# Altium project EasyARM-i.MX283-EV.PrjPcb (part 1 of 2)
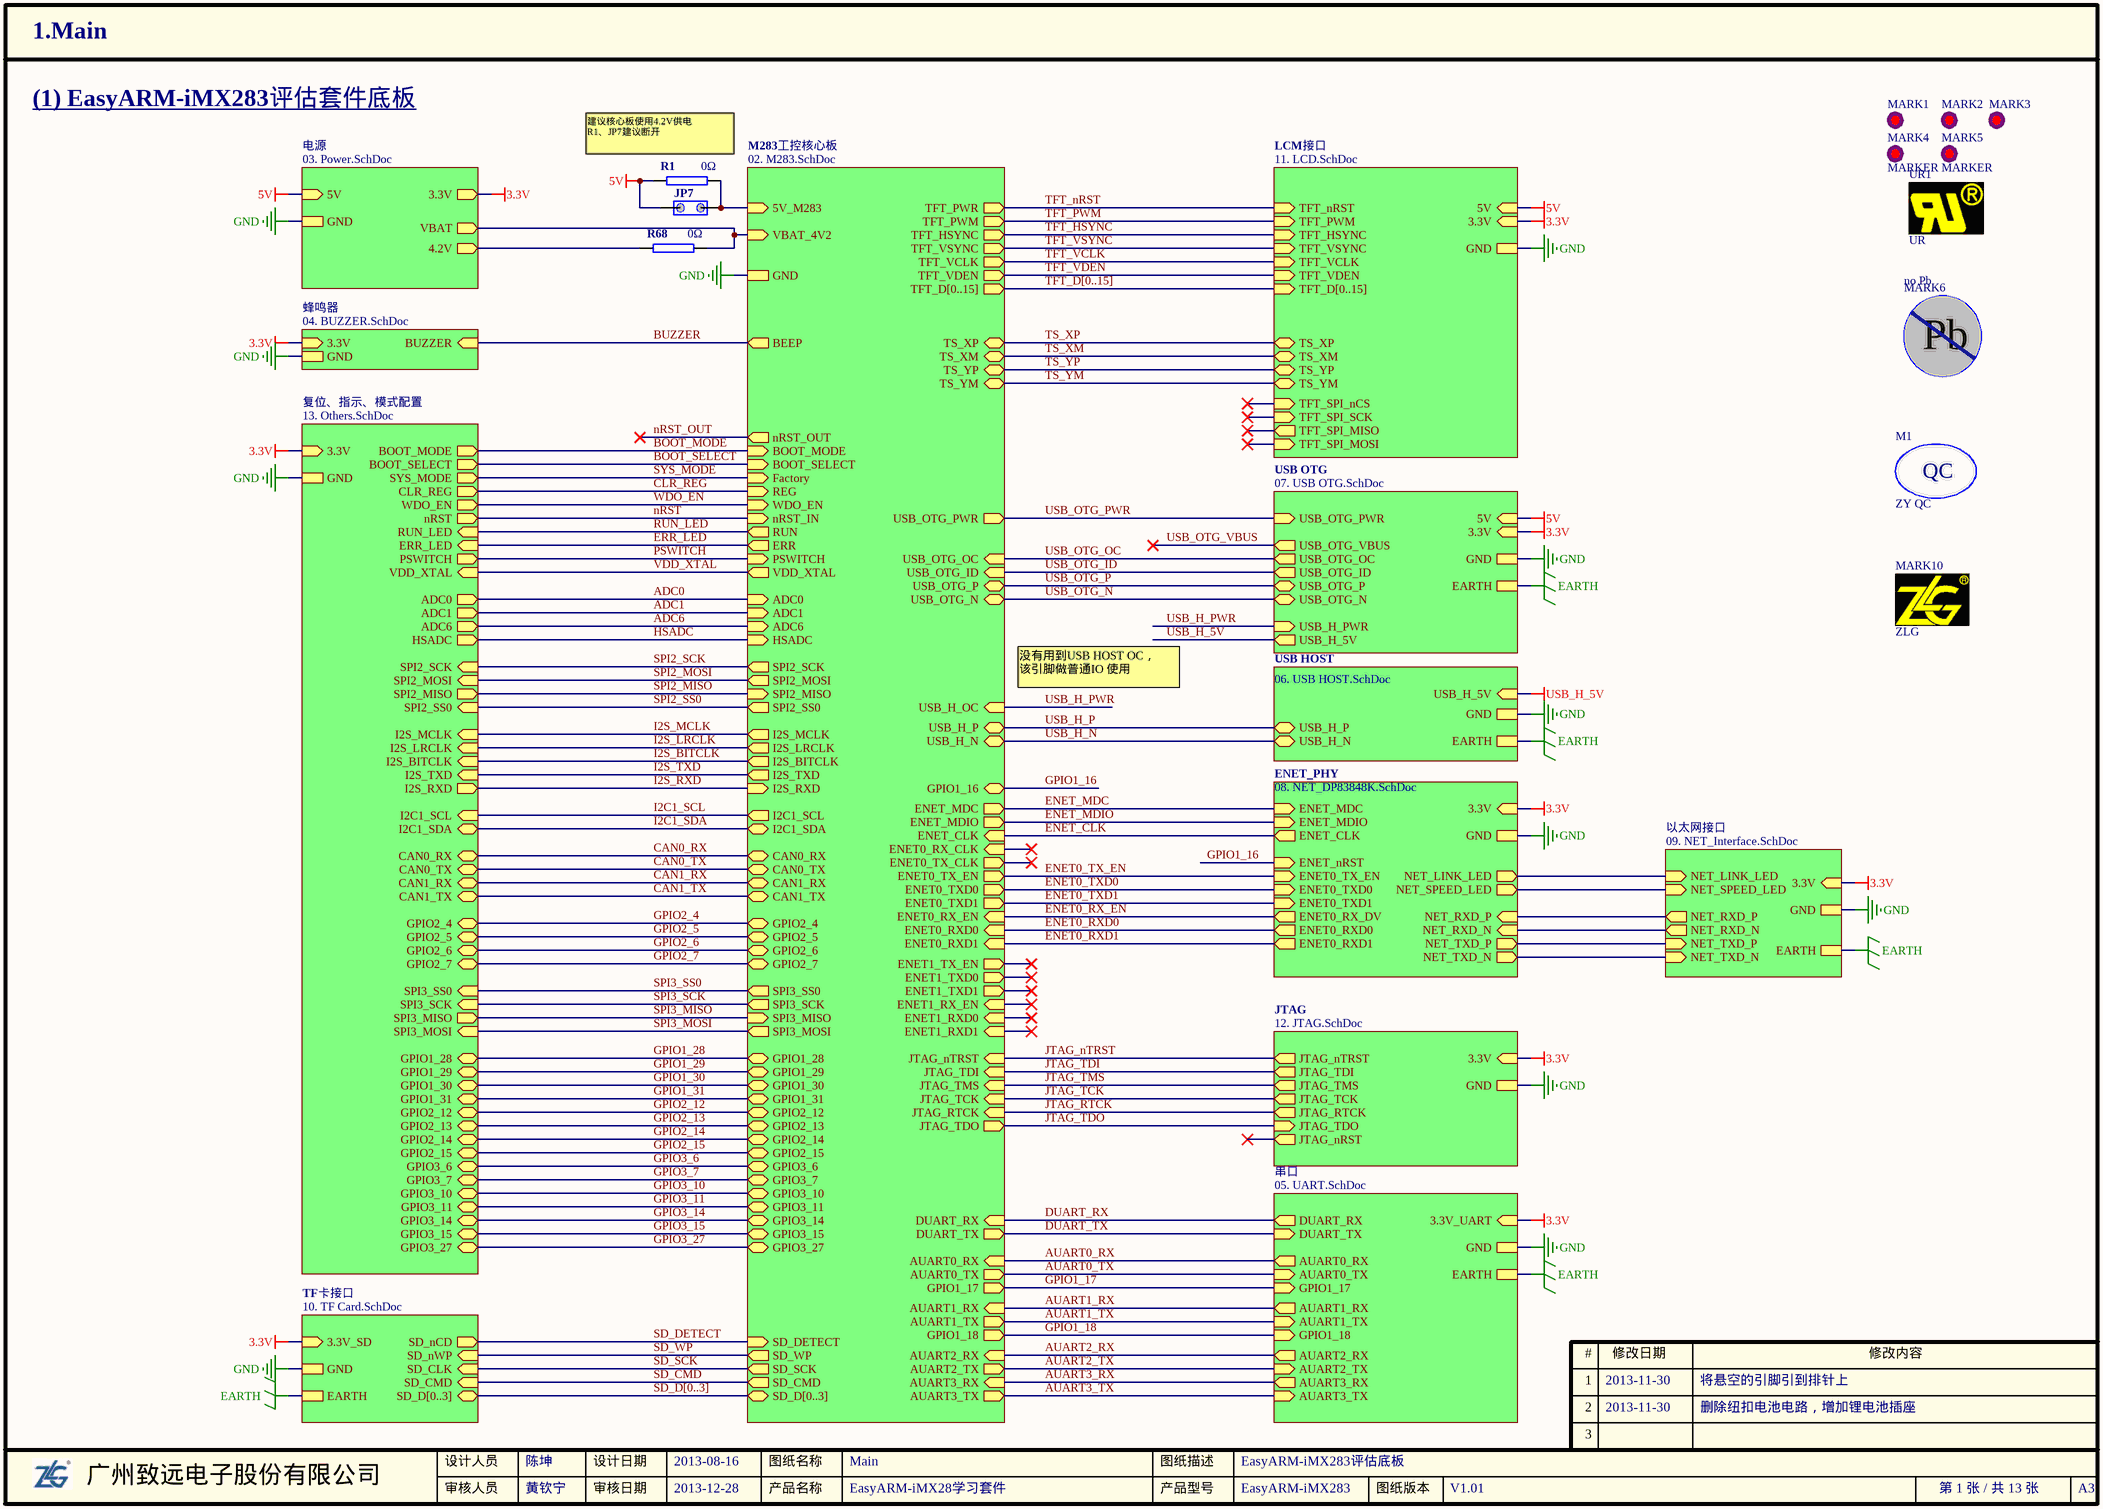
[diagram p0: 01. Main.SchDoc]
ProductModel: SmartARM6540; ProductName: SmartARM6540评估底板
13 sheets, 209 parts. Net scope: hierarchical (ports join the sheet entries above them; power ports are global).
Sheets:
  01. Main.SchDoc
    M283工控核心板 = 02. M283.SchDoc
    串口 = 05. UART.SchDoc
    USB OTG = 07. USB OTG.SchDoc
    USB HOST = 06. USB HOST.SchDoc
    以太网接口 = 09. NET_Interface.SchDoc
    ENET_PHY = 08. NET_DP83848K.SchDoc
    TF卡接口 = 10. TF Card.SchDoc
    LCM接口 = 11. LCD.SchDoc
    电源 = 03. Power.SchDoc
    复位、指示、模式配置 = 13. Others.SchDoc
    JTAG = 12. JTAG.SchDoc
    蜂鸣器 = 04. BUZZER.SchDoc

## Sheet 01. Main.SchDoc
size A3; CheckedBy: 黄钦宁; Author: 陈坤; DocumentNumber: 1; SheetNumber: 1; SheetTotal: 13; PageSetup: Record=PageOptions|CenterHorizontal=True|CenterVertical=True|PrintScale=1.00|XCorrection=1.00|YCorrection=1.00|PrintKind=0|BorderSize=5000000|LeftOffset=0|BottomOffset=0|Orientation=2|PaperLength=1000|PaperWidth=1000|Scale=100|PaperSource=7|PrintQuality=600|MediaType=1|DitherType=10|PaperKind=A4|PrintScaleMode=1; DesignDate: 2013-08-16; CheckDate: 2013-12-28; SheetName: Main; SheetVersion: V1.01; SheetDescription: EasyARM-iMX283评估底板; ModifiedDate1: 2013-11-30; ModifiedDate2: 2013-11-30; ModifiedContent1: 将悬空的引脚引到排针上; ModifiedContent2: 删除纽扣电池电路，增加锂电池插座; ProductName: EasyARM-iMX28学习套件; ProductModel: EasyARM-iMX283

### Parts
JP7  120Ω_EN  [SIP-2]  (value not drawn)
M1  ZY QC  [ZY_QC]  (no BOM)
MARK1  MARKER  [MARKER-C]  (value not drawn)
MARK2  MARKER  [MARKER-C]  (value not drawn)
MARK3  MARKER  [MARKER-C]  (value not drawn)
MARK4  MARKER  [MARKER-C]
MARK5  MARKER  [MARKER-C]
MARK6  no Pb  [ZY_no Pb-4]
MARK10  ZLG  [ZLG0.7]  (no BOM)
R1  0Ω  [0603R]
R68  0Ω  [0603R]
UR1  UR  [ZY_UR-3X2]

### Sub-sheets
ENET_PHY = 08. NET_DP83848K.SchDoc: 3.3V, NET_LINK_LED (out), NET_SPEED_LED (out), NET_RXD_P (in), NET_RXD_N (in), GND, NET_TXD_P (out), NET_TXD_N (out), ENET_nRST (in), ENET_MDC (in), ENET_MDIO (in), ENET0_TX_EN (in), ENET0_RX_DV (out), ENET_CLK (out), ENET0_TXD0 (in), ENET0_TXD1 (in), ENET0_RXD0 (out), ENET0_RXD1 (out)
JTAG = 12. JTAG.SchDoc: 3.3V, GND, JTAG_nTRST (out), JTAG_TDI (out), JTAG_TMS (out), JTAG_TCK (out), JTAG_RTCK (out), JTAG_TDO (in), JTAG_nRST (out)
LCM接口 = 11. LCD.SchDoc: 5V, 3.3V, GND, TS_XP (bidir), TS_XM (bidir), TS_YP (bidir), TS_YM (bidir), TFT_D[0..15] (in), TFT_PWM (in), TFT_HSYNC (in), TFT_VSYNC (in), TFT_VCLK (in), TFT_VDEN (in), TFT_SPI_MISO (out), TFT_SPI_MOSI (in), TFT_SPI_nCS (in), TFT_SPI_SCK (in), TFT_nRST (in)
M283工控核心板 = 02. M283.SchDoc: 5V_M283, GND, Factory (in), BOOT_MODE (in), BOOT_SELECT (in), WDO_EN (in), nRST_IN (in), nRST_OUT (out), RUN (out), ERR (out), BEEP (out), SD_DETECT (in), SD_SCK (out), SD_WP (out), SD_D[0..3] (bidir), SD_CMD (out), DUART_RX (in), DUART_TX (out), TFT_VSYNC (out), TFT_HSYNC (out), TFT_VCLK (out), TFT_VDEN (out), TFT_PWM (out), TFT_D[0..15] (out), TS_XP (bidir), TS_XM (bidir), TS_YP (bidir), TS_YM (bidir), ADC0 (in), ADC1 (in), ADC6 (in), HSADC (in), USB_H_N (bidir), USB_H_P (bidir), USB_OTG_OC (in), USB_OTG_ID (in), USB_OTG_P (bidir), USB_OTG_N (bidir), SPI2_MOSI (out), SPI2_MISO (in), SPI2_SCK (out), SPI2_SS0 (out), JTAG_TCK (in), JTAG_TMS (in), JTAG_TDI (in), JTAG_TDO (out), JTAG_RTCK (in), JTAG_nTRST (in), REG (in), VBAT_4V2 (in), PSWITCH (in), I2S_BITCLK (out), I2S_LRCLK (out), I2S_MCLK (out), I2S_TXD (out), I2S_RXD (in), I2C1_SCL (out), I2C1_SDA (bidir), CAN0_RX (bidir), CAN0_TX (bidir), CAN1_RX (bidir), CAN1_TX (bidir), AUART0_TX (out), AUART0_RX (in), AUART1_RX (in), AUART1_TX (out), GPIO1_17 (out), AUART2_RX (in), AUART2_TX (out), GPIO1_18 (out), AUART3_RX (in), AUART3_TX (out), USB_H_OC (in), USB_OTG_PWR (out), SPI3_MISO (in), SPI3_MOSI (out), SPI3_SCK (out), SPI3_SS0 (out), ENET_MDC (out), ENET_MDIO (out), ENET0_TX_CLK (out), ENET0_TX_EN (out), ENET0_RX_EN (in), ENET0_RX_CLK (in), VDD_XTAL (out), TFT_PWR (out), GPIO3_6 (bidir), GPIO3_7 (bidir), GPIO3_10 (bidir), GPIO3_11 (bidir), GPIO3_14 (bidir), GPIO3_15 (bidir), GPIO3_27 (bidir), GPIO2_12 (bidir), GPIO2_13 (bidir), GPIO2_14 (bidir), GPIO2_15 (bidir), ENET_CLK (in), GPIO1_28 (bidir), GPIO1_29 (bidir), GPIO1_30 (bidir), GPIO1_31 (bidir), GPIO1_16 (bidir), ENET0_TXD0 (out), ENET0_TXD1 (out), ENET0_RXD0 (in), ENET0_RXD1 (in), GPIO2_4 (bidir), GPIO2_5 (bidir), GPIO2_6 (bidir), GPIO2_7 (bidir), ENET1_TX_EN (out), ENET1_RX_EN (in), ENET1_TXD0 (out), ENET1_TXD1 (out), ENET1_RXD0 (in), ENET1_RXD1 (in)
TF卡接口 = 10. TF Card.SchDoc: 3.3V_SD, GND, SD_nCD (out), SD_nWP (in), SD_CLK (in), SD_CMD (in), EARTH, SD_D[0..3] (bidir)
USB HOST = 06. USB HOST.SchDoc: USB_H_5V, GND, USB_H_P (bidir), USB_H_N (bidir), EARTH
USB OTG = 07. USB OTG.SchDoc: 5V, GND, USB_OTG_PWR (in), USB_OTG_ID (out), USB_OTG_P (bidir), USB_OTG_N (bidir), EARTH, USB_OTG_OC (out), USB_OTG_VBUS (out), USB_H_PWR (in), USB_H_5V (out), 3.3V (in)
串口 = 05. UART.SchDoc: 3.3V_UART (in), GND, DUART_RX (out), DUART_TX (in), EARTH, AUART0_RX (out), AUART0_TX (in), AUART1_RX (out), AUART1_TX (in), GPIO1_17 (in), GPIO1_18 (in), AUART2_RX (out), AUART3_RX (out), AUART3_TX (in), AUART2_TX (in)
以太网接口 = 09. NET_Interface.SchDoc: 3.3V (in), GND, NET_LINK_LED (in), NET_SPEED_LED (in), NET_RXD_P (out), NET_RXD_N (out), EARTH, NET_TXD_P (in), NET_TXD_N (in)
复位、指示、模式配置 = 13. Others.SchDoc: 3.3V, GND, BOOT_MODE (out), BOOT_SELECT (out), SYS_MODE (out), WDO_EN (out), nRST (out), RUN_LED (in), ERR_LED (in), ADC0 (out), ADC1 (out), ADC6 (out), HSADC (out), SPI2_SCK (in), SPI2_MOSI (in), SPI2_MISO (out), SPI2_SS0 (in), CLR_REG (out), PSWITCH (out), I2S_BITCLK (in), I2S_MCLK (in), I2S_LRCLK (in), I2S_TXD (in), I2S_RXD (out), I2C1_SCL (in), I2C1_SDA (bidir), VDD_XTAL (in), GPIO2_4 (bidir), GPIO2_5 (bidir), GPIO2_6 (bidir), GPIO2_7 (bidir), CAN0_RX (bidir), CAN0_TX (bidir), CAN1_RX (bidir), CAN1_TX (bidir), SPI3_SCK (in), SPI3_MOSI (in), SPI3_MISO (out), SPI3_SS0 (in), GPIO3_6 (bidir), GPIO3_7 (bidir), GPIO3_10 (bidir), GPIO3_11 (bidir), GPIO3_14 (bidir), GPIO3_15 (bidir), GPIO3_27 (bidir), GPIO2_12 (bidir), GPIO2_13 (bidir), GPIO2_14 (bidir), GPIO2_15 (bidir), GPIO1_28 (bidir), GPIO1_29 (bidir), GPIO1_30 (bidir), GPIO1_31 (bidir)
电源 = 03. Power.SchDoc: 3.3V, GND, 5V, VBAT (out), 4.2V (out)
蜂鸣器 = 04. BUZZER.SchDoc: 3.3V (in), BUZZER (in), GND

### Nets
3.3V: sheet 串口/3.3V_UART, sheet USB OTG/3.3V, sheet 以太网接口/3.3V, sheet ENET_PHY/3.3V, sheet TF卡接口/3.3V_SD, sheet LCM接口/3.3V, sheet 电源/3.3V, sheet 复位、指示、模式配置/3.3V, sheet JTAG/3.3V, sheet 蜂鸣器/3.3V
4.2V: R68.1 ; sheet 电源/4.2V
5V: JP7.1 R1.1 ; sheet USB OTG/5V, sheet LCM接口/5V, sheet 电源/5V
5V_M283: JP7.2 R1.2 ; sheet M283工控核心板/5V_M283
EARTH: sheet 串口/EARTH, sheet USB OTG/EARTH, sheet USB HOST/EARTH, sheet 以太网接口/EARTH, sheet TF卡接口/EARTH
GND: sheet M283工控核心板/GND, sheet 串口/GND, sheet USB OTG/GND, sheet USB HOST/GND, sheet 以太网接口/GND, sheet ENET_PHY/GND, sheet TF卡接口/GND, sheet LCM接口/GND, sheet 电源/GND, sheet 复位、指示、模式配置/GND, sheet JTAG/GND, sheet 蜂鸣器/GND
USB_H_5V: sheet USB OTG/USB_H_5V, sheet USB HOST/USB_H_5V
VBAT: R68.2 ; sheet M283工控核心板/VBAT_4V2, sheet 电源/VBAT
VDD_XTAL: sheet M283工控核心板/VDD_XTAL, sheet 复位、指示、模式配置/VDD_XTAL
ADC0: sheet M283工控核心板/ADC0, sheet 复位、指示、模式配置/ADC0
ADC1: sheet M283工控核心板/ADC1, sheet 复位、指示、模式配置/ADC1
ADC6: sheet M283工控核心板/ADC6, sheet 复位、指示、模式配置/ADC6
AUART0_RX: sheet M283工控核心板/AUART0_RX, sheet 串口/AUART0_RX
AUART0_TX: sheet M283工控核心板/AUART0_TX, sheet 串口/AUART0_TX
AUART1_RX: sheet M283工控核心板/AUART1_RX, sheet 串口/AUART1_RX
AUART1_TX: sheet M283工控核心板/AUART1_TX, sheet 串口/AUART1_TX
AUART2_RX: sheet M283工控核心板/AUART2_RX, sheet 串口/AUART2_RX
AUART2_TX: sheet M283工控核心板/AUART2_TX, sheet 串口/AUART2_TX
AUART3_RX: sheet M283工控核心板/AUART3_RX, sheet 串口/AUART3_RX
AUART3_TX: sheet M283工控核心板/AUART3_TX, sheet 串口/AUART3_TX
BOOT_MODE: sheet M283工控核心板/BOOT_MODE, sheet 复位、指示、模式配置/BOOT_MODE
BOOT_SELECT: sheet M283工控核心板/BOOT_SELECT, sheet 复位、指示、模式配置/BOOT_SELECT
BUZZER: sheet M283工控核心板/BEEP, sheet 蜂鸣器/BUZZER  [project net BEEP]
CAN0_RX: sheet M283工控核心板/CAN0_RX, sheet 复位、指示、模式配置/CAN0_RX
CAN0_TX: sheet M283工控核心板/CAN0_TX, sheet 复位、指示、模式配置/CAN0_TX
CAN1_RX: sheet M283工控核心板/CAN1_RX, sheet 复位、指示、模式配置/CAN1_RX
CAN1_TX: sheet M283工控核心板/CAN1_TX, sheet 复位、指示、模式配置/CAN1_TX
CLR_REG: sheet M283工控核心板/REG, sheet 复位、指示、模式配置/CLR_REG
DUART_RX: sheet M283工控核心板/DUART_RX, sheet 串口/DUART_RX
DUART_TX: sheet M283工控核心板/DUART_TX, sheet 串口/DUART_TX
ENET0_RX_EN: sheet M283工控核心板/ENET0_RX_EN, sheet ENET_PHY/ENET0_RX_DV  [project net ENET0_RX_DV]
ENET0_RXD0: sheet M283工控核心板/ENET0_RXD0, sheet ENET_PHY/ENET0_RXD0
ENET0_RXD1: sheet M283工控核心板/ENET0_RXD1, sheet ENET_PHY/ENET0_RXD1
ENET0_TX_EN: sheet M283工控核心板/ENET0_TX_EN, sheet ENET_PHY/ENET0_TX_EN
ENET0_TXD0: sheet M283工控核心板/ENET0_TXD0, sheet ENET_PHY/ENET0_TXD0
ENET0_TXD1: sheet M283工控核心板/ENET0_TXD1, sheet ENET_PHY/ENET0_TXD1
ENET_CLK: sheet M283工控核心板/ENET_CLK, sheet ENET_PHY/ENET_CLK
ENET_MDC: sheet M283工控核心板/ENET_MDC, sheet ENET_PHY/ENET_MDC
ENET_MDIO: sheet M283工控核心板/ENET_MDIO, sheet ENET_PHY/ENET_MDIO
ERR_LED: sheet M283工控核心板/ERR, sheet 复位、指示、模式配置/ERR_LED  [project net ERR]
GPIO1_16: sheet M283工控核心板/GPIO1_16, sheet ENET_PHY/ENET_nRST  [project net ENET_nRST]
GPIO1_17: sheet M283工控核心板/GPIO1_17, sheet 串口/GPIO1_17
GPIO1_18: sheet M283工控核心板/GPIO1_18, sheet 串口/GPIO1_18
GPIO1_28: sheet M283工控核心板/GPIO1_28, sheet 复位、指示、模式配置/GPIO1_28
GPIO1_29: sheet M283工控核心板/GPIO1_29, sheet 复位、指示、模式配置/GPIO1_29
GPIO1_30: sheet M283工控核心板/GPIO1_30, sheet 复位、指示、模式配置/GPIO1_30
GPIO1_31: sheet M283工控核心板/GPIO1_31, sheet 复位、指示、模式配置/GPIO1_31
GPIO2_4: sheet M283工控核心板/GPIO2_4, sheet 复位、指示、模式配置/GPIO2_4
GPIO2_5: sheet M283工控核心板/GPIO2_5, sheet 复位、指示、模式配置/GPIO2_5
GPIO2_6: sheet M283工控核心板/GPIO2_6, sheet 复位、指示、模式配置/GPIO2_6
GPIO2_7: sheet M283工控核心板/GPIO2_7, sheet 复位、指示、模式配置/GPIO2_7
GPIO2_12: sheet M283工控核心板/GPIO2_12, sheet 复位、指示、模式配置/GPIO2_12
GPIO2_13: sheet M283工控核心板/GPIO2_13, sheet 复位、指示、模式配置/GPIO2_13
GPIO2_14: sheet M283工控核心板/GPIO2_14, sheet 复位、指示、模式配置/GPIO2_14
GPIO2_15: sheet M283工控核心板/GPIO2_15, sheet 复位、指示、模式配置/GPIO2_15
GPIO3_6: sheet M283工控核心板/GPIO3_6, sheet 复位、指示、模式配置/GPIO3_6
GPIO3_7: sheet M283工控核心板/GPIO3_7, sheet 复位、指示、模式配置/GPIO3_7
GPIO3_10: sheet M283工控核心板/GPIO3_10, sheet 复位、指示、模式配置/GPIO3_10
GPIO3_11: sheet M283工控核心板/GPIO3_11, sheet 复位、指示、模式配置/GPIO3_11
GPIO3_14: sheet M283工控核心板/GPIO3_14, sheet 复位、指示、模式配置/GPIO3_14
GPIO3_15: sheet M283工控核心板/GPIO3_15, sheet 复位、指示、模式配置/GPIO3_15
GPIO3_27: sheet M283工控核心板/GPIO3_27, sheet 复位、指示、模式配置/GPIO3_27
HSADC: sheet M283工控核心板/HSADC, sheet 复位、指示、模式配置/HSADC
I2C1_SCL: sheet M283工控核心板/I2C1_SCL, sheet 复位、指示、模式配置/I2C1_SCL
I2C1_SDA: sheet M283工控核心板/I2C1_SDA, sheet 复位、指示、模式配置/I2C1_SDA
I2S_BITCLK: sheet M283工控核心板/I2S_BITCLK, sheet 复位、指示、模式配置/I2S_BITCLK
I2S_LRCLK: sheet M283工控核心板/I2S_LRCLK, sheet 复位、指示、模式配置/I2S_LRCLK
I2S_MCLK: sheet M283工控核心板/I2S_MCLK, sheet 复位、指示、模式配置/I2S_MCLK
I2S_RXD: sheet M283工控核心板/I2S_RXD, sheet 复位、指示、模式配置/I2S_RXD
I2S_TXD: sheet M283工控核心板/I2S_TXD, sheet 复位、指示、模式配置/I2S_TXD
JTAG_nTRST: sheet M283工控核心板/JTAG_nTRST, sheet JTAG/JTAG_nTRST
JTAG_RTCK: sheet M283工控核心板/JTAG_RTCK, sheet JTAG/JTAG_RTCK
JTAG_TCK: sheet M283工控核心板/JTAG_TCK, sheet JTAG/JTAG_TCK
JTAG_TDI: sheet M283工控核心板/JTAG_TDI, sheet JTAG/JTAG_TDI
JTAG_TDO: sheet M283工控核心板/JTAG_TDO, sheet JTAG/JTAG_TDO
JTAG_TMS: sheet M283工控核心板/JTAG_TMS, sheet JTAG/JTAG_TMS
NET_LINK_LED: sheet 以太网接口/NET_LINK_LED, sheet ENET_PHY/NET_LINK_LED
NET_RXD_N: sheet 以太网接口/NET_RXD_N, sheet ENET_PHY/NET_RXD_N
NET_RXD_P: sheet 以太网接口/NET_RXD_P, sheet ENET_PHY/NET_RXD_P
NET_SPEED_LED: sheet 以太网接口/NET_SPEED_LED, sheet ENET_PHY/NET_SPEED_LED
NET_TXD_N: sheet 以太网接口/NET_TXD_N, sheet ENET_PHY/NET_TXD_N
NET_TXD_P: sheet 以太网接口/NET_TXD_P, sheet ENET_PHY/NET_TXD_P
nRST: sheet M283工控核心板/nRST_IN, sheet 复位、指示、模式配置/nRST
PSWITCH: sheet M283工控核心板/PSWITCH, sheet 复位、指示、模式配置/PSWITCH
RUN_LED: sheet M283工控核心板/RUN, sheet 复位、指示、模式配置/RUN_LED  [project net RUN]
SD_CMD: sheet M283工控核心板/SD_CMD, sheet TF卡接口/SD_CMD
SD_DETECT: sheet M283工控核心板/SD_DETECT, sheet TF卡接口/SD_nCD
SD_SCK: sheet M283工控核心板/SD_SCK, sheet TF卡接口/SD_CLK  [project net SD_CLK]
SD_WP: sheet M283工控核心板/SD_WP, sheet TF卡接口/SD_nWP  [project net SD_nWP]
SPI2_MISO: sheet M283工控核心板/SPI2_MISO, sheet 复位、指示、模式配置/SPI2_MISO
SPI2_MOSI: sheet M283工控核心板/SPI2_MOSI, sheet 复位、指示、模式配置/SPI2_MOSI
SPI2_SCK: sheet M283工控核心板/SPI2_SCK, sheet 复位、指示、模式配置/SPI2_SCK
SPI2_SS0: sheet M283工控核心板/SPI2_SS0, sheet 复位、指示、模式配置/SPI2_SS0
SPI3_MISO: sheet M283工控核心板/SPI3_MISO, sheet 复位、指示、模式配置/SPI3_MISO
SPI3_MOSI: sheet M283工控核心板/SPI3_MOSI, sheet 复位、指示、模式配置/SPI3_MOSI
SPI3_SCK: sheet M283工控核心板/SPI3_SCK, sheet 复位、指示、模式配置/SPI3_SCK
SPI3_SS0: sheet M283工控核心板/SPI3_SS0, sheet 复位、指示、模式配置/SPI3_SS0
SYS_MODE: sheet M283工控核心板/Factory, sheet 复位、指示、模式配置/SYS_MODE  [project net Factory]
TFT_HSYNC: sheet M283工控核心板/TFT_HSYNC, sheet LCM接口/TFT_HSYNC
TFT_nRST: sheet M283工控核心板/TFT_PWR, sheet LCM接口/TFT_nRST
TFT_PWM: sheet M283工控核心板/TFT_PWM, sheet LCM接口/TFT_PWM
TFT_VCLK: sheet M283工控核心板/TFT_VCLK, sheet LCM接口/TFT_VCLK
TFT_VDEN: sheet M283工控核心板/TFT_VDEN, sheet LCM接口/TFT_VDEN
TFT_VSYNC: sheet M283工控核心板/TFT_VSYNC, sheet LCM接口/TFT_VSYNC
TS_XM: sheet M283工控核心板/TS_XM, sheet LCM接口/TS_XM
TS_XP: sheet M283工控核心板/TS_XP, sheet LCM接口/TS_XP
TS_YM: sheet M283工控核心板/TS_YM, sheet LCM接口/TS_YM
TS_YP: sheet M283工控核心板/TS_YP, sheet LCM接口/TS_YP
USB_H_N: sheet M283工控核心板/USB_H_N, sheet USB HOST/USB_H_N
USB_H_P: sheet M283工控核心板/USB_H_P, sheet USB HOST/USB_H_P
USB_H_PWR: sheet M283工控核心板/USB_H_OC, sheet USB OTG/USB_H_PWR  [project net USB_H_OC]
USB_OTG_ID: sheet M283工控核心板/USB_OTG_ID, sheet USB OTG/USB_OTG_ID
USB_OTG_N: sheet M283工控核心板/USB_OTG_N, sheet USB OTG/USB_OTG_N
USB_OTG_OC: sheet M283工控核心板/USB_OTG_OC, sheet USB OTG/USB_OTG_OC
USB_OTG_P: sheet M283工控核心板/USB_OTG_P, sheet USB OTG/USB_OTG_P
USB_OTG_PWR: sheet M283工控核心板/USB_OTG_PWR, sheet USB OTG/USB_OTG_PWR
WDO_EN: sheet M283工控核心板/WDO_EN, sheet 复位、指示、模式配置/WDO_EN

Not connected (* = marked no-connect by the designer): MARK1 0; MARK2 0; MARK3 0; MARK4 0; MARK5 0

### Buses and harness runs
bus SD_D[0..3] = sheet M283工控核心板/SD_D[0..3] = sheet TF卡接口/SD_D[0..3]
bus TFT_D[0..15] = sheet LCM接口/TFT_D[0..15] = sheet M283工控核心板/TFT_D[0..15]

### Notes on the sheet
- (1) EasyARM-iMX283评估套件底板
- (near R1) 建议核心板使用4.2V供电
  R1、JP7建议断开
- 没有用到USB HOST OC，
  该引脚做普通IO 使用
- 1
- #
- 修改日期
- 修改内容
- 2
- 3
- 广州致远电子股份有限公司
- 设计人员
- 审核人员
- 设计日期
- 审核日期
- 产品名称
- 图纸名称
- 产品型号
- 图纸描述
- 图纸版本
- A3
- (in symbol no Pb) Pb
- (in symbol ZY QC) QC

### Library data of the parts
JP7 = JMP2
R1 R68 = 1.01.01.0001: 0Ω,0603,*,RoHS; 名称: 电阻; 封装: 0603; 设备封装名称: R0603_0R; 贴片和直插: SMT; 器件优选方案: 优先选用; 物料代码: 1.01.01.0001; Value: 0Ω; 厂商: *; RoHS: RoHS; 型号: 0Ω; ComponentLink1Description: ErpDataInfo; ComponentLink1URL: http://erp.zlgmcu.com/ErpExt/ErpData/ListMateriel.aspx?pkey=1.01.01.0001

## Sheet 02. M283.SchDoc
size A3; CheckedBy: 黄钦宁; Author: 陈坤; DocumentNumber: 2; SheetNumber: 2; SheetTotal: 13; PageSetup: Record=PageOptions|CenterHorizontal=True|CenterVertical=True|PrintScale=1.00|XCorrection=1.00|YCorrection=1.00|PrintKind=0|BorderSize=5000000|LeftOffset=0|BottomOffset=0|Orientation=2|PaperLength=1000|PaperWidth=1000|Scale=100|PaperSource=7|PrintQuality=600|MediaType=1|DitherType=10|PaperKind=A4|PrintScaleMode=1; DesignDate: 2013-08-16; CheckDate: 2013-12-28; SheetName: M283; SheetVersion: V1.01; SheetDescription: EasyARM-iMX283工控核心板; ModifiedDate1: 2013-11-30; ModifiedContent1: 修改引脚顺序; ProductName: EasyARM-iMX28学习套件; ProductModel: EasyARM-iMX283
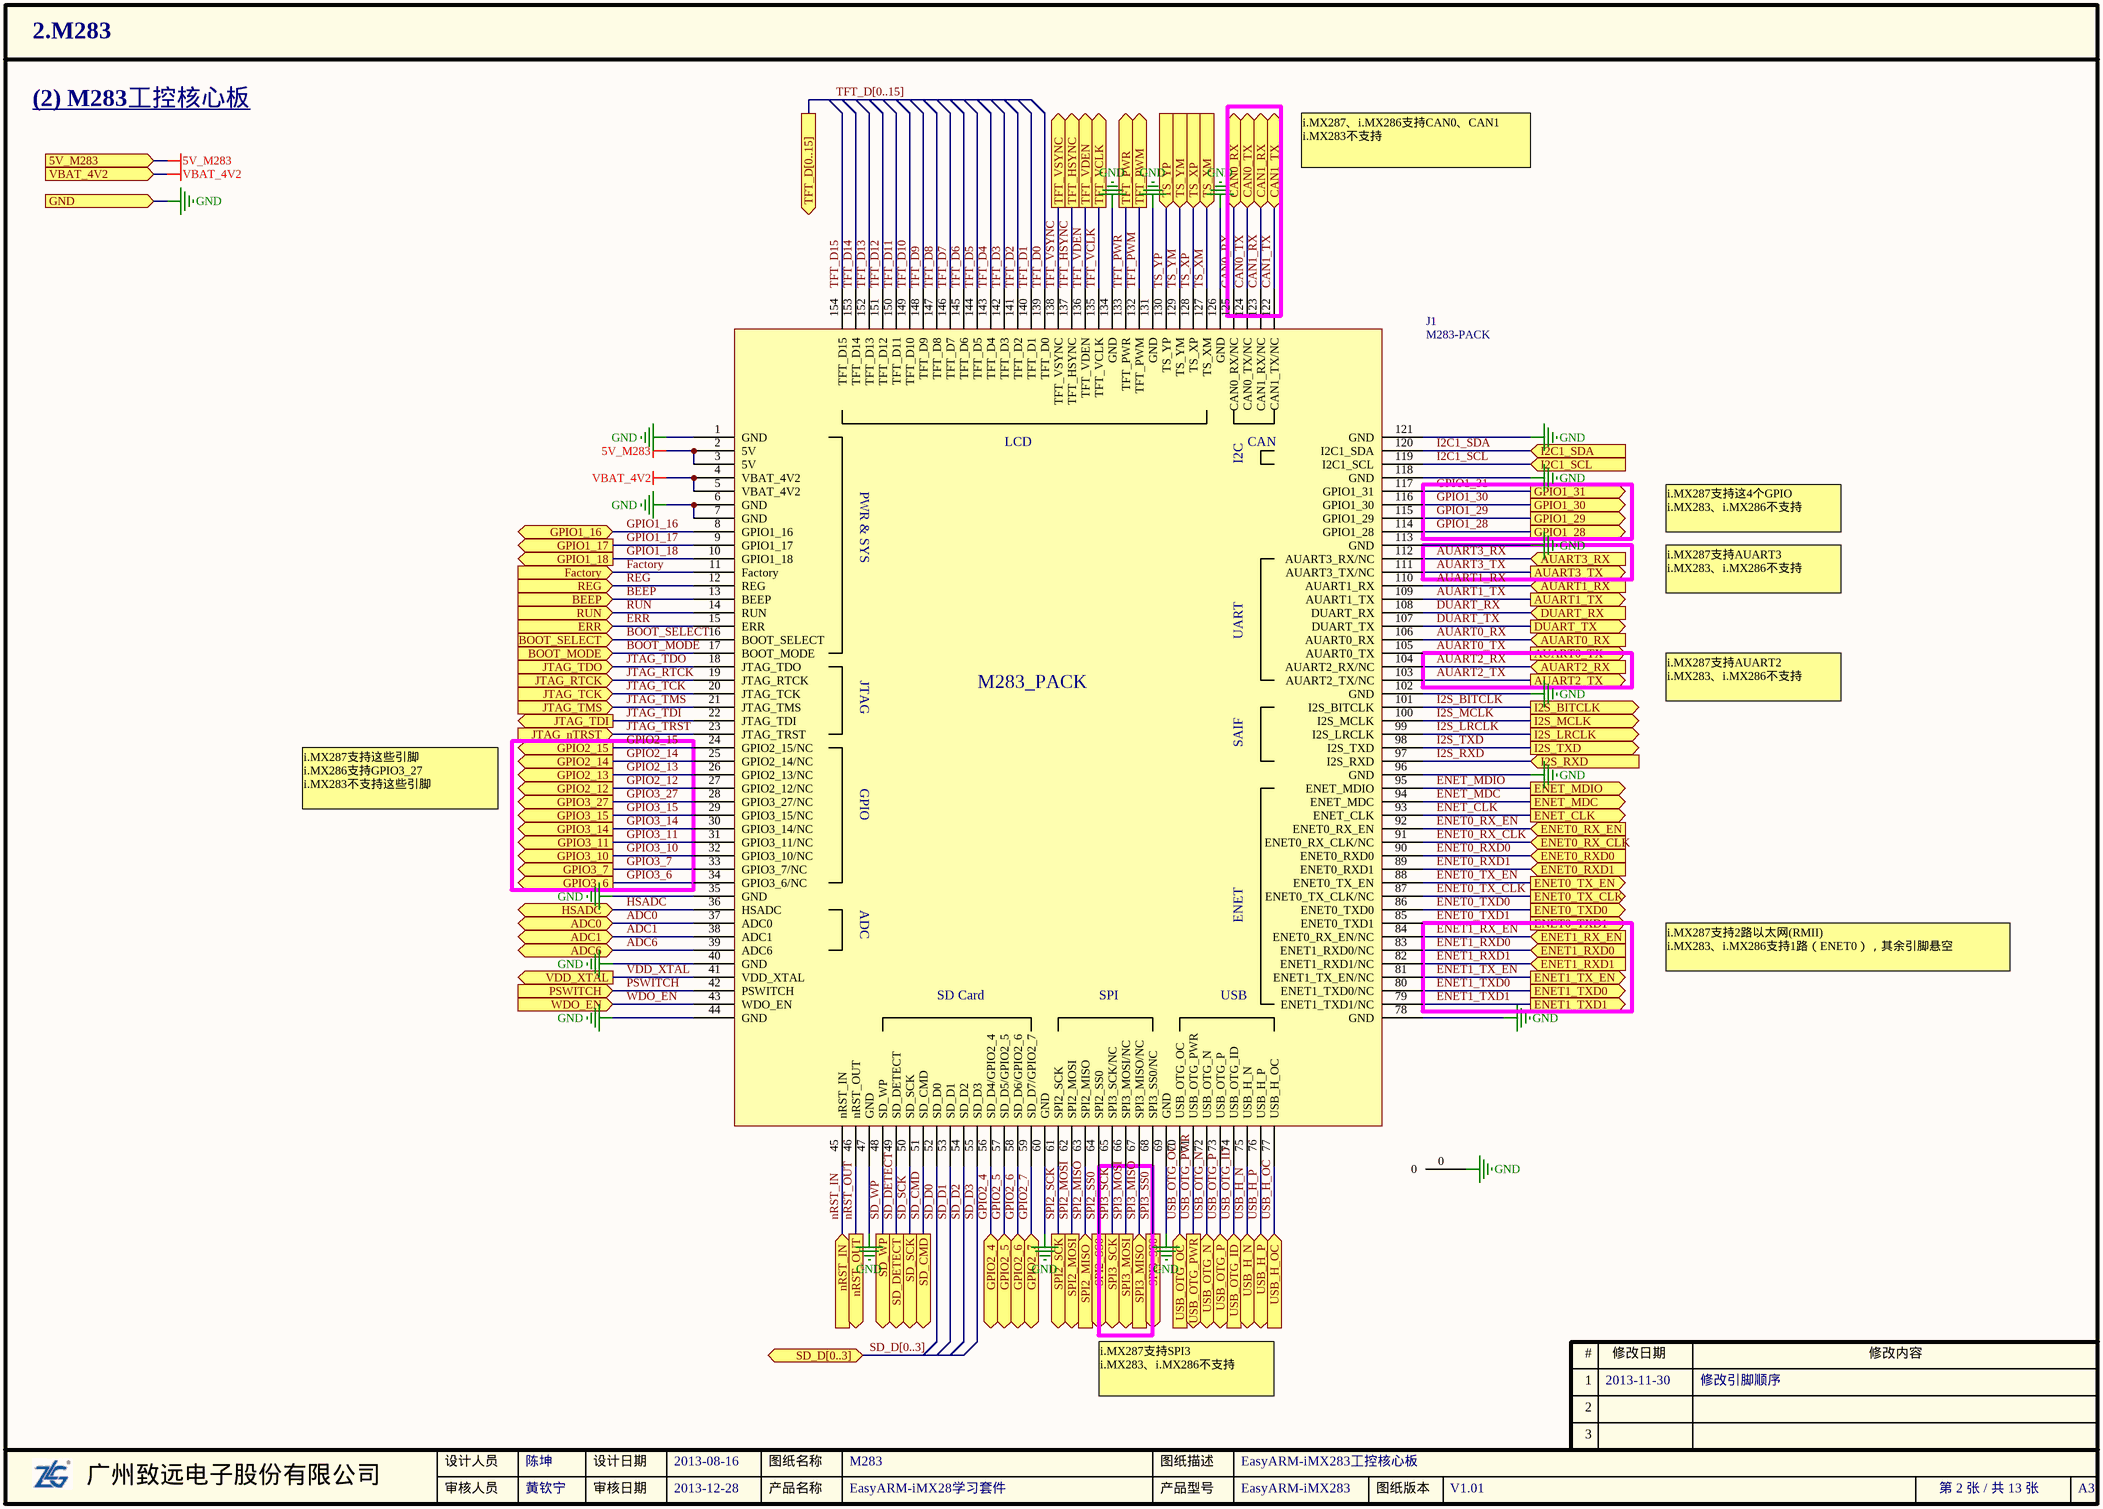
[diagram p1: 02. M283.SchDoc]

### Parts
J1  M283-PACK  [M283-154]

### Ports
5V_M283, ADC0 (bidir), ADC1 (bidir), ADC6 (bidir), AUART0_RX (in), AUART0_TX (out), AUART1_RX (in), AUART1_TX (out), AUART2_RX (in), AUART2_TX (out), AUART3_RX (in), AUART3_TX (out), BEEP (in), BOOT_MODE (in), BOOT_SELECT (in), CAN0_RX (bidir), CAN0_TX (bidir), CAN1_RX (bidir), CAN1_TX (bidir), DUART_RX (in), DUART_TX (out), ENET0_RX_CLK (in), ENET0_RX_EN (in), ENET0_RXD0 (in), ENET0_RXD1 (in), ENET0_TX_CLK (out), ENET0_TX_EN (out), ENET0_TXD0 (out), ENET0_TXD1 (out), ENET1_RX_EN (in), ENET1_RXD0 (in), ENET1_RXD1 (in), ENET1_TX_EN (out), ENET1_TXD0 (out), ENET1_TXD1 (out), ENET_CLK (out), ENET_MDC (out), ENET_MDIO (out), ERR (in), Factory (in), GND, GPIO1_16 (bidir), GPIO1_17 (out), GPIO1_18 (out), GPIO1_28 (out), GPIO1_29 (out), GPIO1_30 (out), GPIO1_31 (out), GPIO2_4 (bidir), GPIO2_5 (bidir), GPIO2_6 (bidir), GPIO2_7 (bidir), GPIO2_12 (out), GPIO2_13 (out), GPIO2_14 (out), GPIO2_15 (out), GPIO3_6 (out), GPIO3_7 (out), GPIO3_10 (out), GPIO3_11 (out), GPIO3_14 (out), GPIO3_15 (out), GPIO3_27 (out), HSADC (bidir), I2C1_SCL (in), I2C1_SDA (in), I2S_BITCLK (out), I2S_LRCLK (out), I2S_MCLK (out), I2S_RXD (in), I2S_TXD (out), JTAG_nTRST (in), JTAG_RTCK (in), JTAG_TCK (in), JTAG_TDI (out), JTAG_TDO (in), JTAG_TMS (in), nRST_IN (in), nRST_OUT (out), PSWITCH (in), REG (in), RUN (in), SD_CMD (out), SD_D[0..3] (bidir), SD_DETECT (out), SD_SCK (out), SD_WP (out), SPI2_MISO (in), SPI2_MOSI (out), SPI2_SCK (out), SPI2_SS0 (out), SPI3_MISO (in), SPI3_MOSI (out), SPI3_SCK (out), SPI3_SS0 (out), TFT_D[0..15] (out), TFT_HSYNC (out), TFT_PWM (out), TFT_PWR (out), TFT_VCLK (out), TFT_VDEN (out), TFT_VSYNC (out), TS_XM (in), TS_XP (in), TS_YM (in), TS_YP (in), USB_H_N (bidir), USB_H_OC (in), USB_H_P (bidir), USB_OTG_ID (in), USB_OTG_N (bidir), USB_OTG_OC (in), USB_OTG_P (bidir), USB_OTG_PWR (out), VBAT_4V2, VDD_XTAL (out), WDO_EN (in)

### Nets
5V_M283: J1.2(5V) J1.3(5V) ; port 5V_M283
GND: J1.0 J1.1(GND) J1.6(GND) J1.7(GND) J1.35(GND) J1.40(GND) J1.44(GND) J1.47(GND) J1.60(GND) J1.69(GND) J1.78(GND) J1.96(GND) J1.102(GND) J1.113(GND) J1.118(GND) J1.121(GND) J1.126(GND) J1.131(GND) J1.134(GND) ; port GND
VBAT_4V2: J1.4(VBAT_4V2) J1.5(VBAT_4V2) ; port VBAT_4V2  [project net VBAT]
VDD_XTAL: J1.41(VDD_XTAL) ; port VDD_XTAL
ADC0: J1.37(ADC0) ; port ADC0
ADC1: J1.38(ADC1) ; port ADC1
ADC6: J1.39(ADC6) ; port ADC6
AUART0_RX: J1.106(AUART0_RX) ; port AUART0_RX
AUART0_TX: J1.105(AUART0_TX) ; port AUART0_TX
AUART1_RX: J1.110(AUART1_RX) ; port AUART1_RX
AUART1_TX: J1.109(AUART1_TX) ; port AUART1_TX
AUART2_RX: J1.104(AUART2_RX/NC) ; port AUART2_RX
AUART2_TX: J1.103(AUART2_TX/NC) ; port AUART2_TX
AUART3_RX: J1.112(AUART3_RX/NC) ; port AUART3_RX
AUART3_TX: J1.111(AUART3_TX/NC) ; port AUART3_TX
BEEP: J1.13(BEEP) ; port BEEP
BOOT_MODE: J1.17(BOOT_MODE) ; port BOOT_MODE
BOOT_SELECT: J1.16(BOOT_SELECT) ; port BOOT_SELECT
CAN0_RX: J1.125(CAN0_RX/NC) ; port CAN0_RX
CAN0_TX: J1.124(CAN0_TX/NC) ; port CAN0_TX
CAN1_RX: J1.123(CAN1_RX/NC) ; port CAN1_RX
CAN1_TX: J1.122(CAN1_TX/NC) ; port CAN1_TX
DUART_RX: J1.108(DUART_RX) ; port DUART_RX
DUART_TX: J1.107(DUART_TX) ; port DUART_TX
ENET0_RX_CLK: J1.91(ENET0_RX_CLK/NC) ; port ENET0_RX_CLK
ENET0_RX_EN: J1.92(ENET0_RX_EN) ; port ENET0_RX_EN  [project net ENET0_RX_DV]
ENET0_RXD0: J1.90(ENET0_RXD0) ; port ENET0_RXD0
ENET0_RXD1: J1.89(ENET0_RXD1) ; port ENET0_RXD1
ENET0_TX_CLK: J1.87(ENET0_TX_CLK/NC) ; port ENET0_TX_CLK
ENET0_TX_EN: J1.88(ENET0_TX_EN) ; port ENET0_TX_EN
ENET0_TXD0: J1.86(ENET0_TXD0) ; port ENET0_TXD0
ENET0_TXD1: J1.85(ENET0_TXD1) ; port ENET0_TXD1
ENET1_RX_EN: J1.84(ENET0_RX_EN/NC) ; port ENET1_RX_EN
ENET1_RXD0: J1.83(ENET1_RXD0/NC) ; port ENET1_RXD0
ENET1_RXD1: J1.82(ENET1_RXD1/NC) ; port ENET1_RXD1
ENET1_TX_EN: J1.81(ENET1_TX_EN/NC) ; port ENET1_TX_EN
ENET1_TXD0: J1.80(ENET1_TXD0/NC) ; port ENET1_TXD0
ENET1_TXD1: J1.79(ENET1_TXD1/NC) ; port ENET1_TXD1
ENET_CLK: J1.93(ENET_CLK) ; port ENET_CLK
ENET_MDC: J1.94(ENET_MDC) ; port ENET_MDC
ENET_MDIO: J1.95(ENET_MDIO) ; port ENET_MDIO
ERR: J1.15(ERR) ; port ERR
Factory: J1.11(Factory) ; port Factory
GPIO1_16: J1.8(GPIO1_16) ; port GPIO1_16  [project net ENET_nRST]
GPIO1_17: J1.9(GPIO1_17) ; port GPIO1_17
GPIO1_18: J1.10(GPIO1_18) ; port GPIO1_18
GPIO1_28: J1.114(GPIO1_28) ; port GPIO1_28
GPIO1_29: J1.115(GPIO1_29) ; port GPIO1_29
GPIO1_30: J1.116(GPIO1_30) ; port GPIO1_30
GPIO1_31: J1.117(GPIO1_31) ; port GPIO1_31
GPIO2_4: J1.56(SD_D4/GPIO2_4) ; port GPIO2_4
GPIO2_5: J1.57(SD_D5/GPIO2_5) ; port GPIO2_5
GPIO2_6: J1.58(SD_D6/GPIO2_6) ; port GPIO2_6
GPIO2_7: J1.59(SD_D7/GPIO2_7) ; port GPIO2_7
GPIO2_12: J1.27(GPIO2_12/NC) ; port GPIO2_12
GPIO2_13: J1.26(GPIO2_13/NC) ; port GPIO2_13
GPIO2_14: J1.25(GPIO2_14/NC) ; port GPIO2_14
GPIO2_15: J1.24(GPIO2_15/NC) ; port GPIO2_15
GPIO3_6: J1.34(GPIO3_6/NC) ; port GPIO3_6
GPIO3_7: J1.33(GPIO3_7/NC) ; port GPIO3_7
GPIO3_10: J1.32(GPIO3_10/NC) ; port GPIO3_10
GPIO3_11: J1.31(GPIO3_11/NC) ; port GPIO3_11
GPIO3_14: J1.30(GPIO3_14/NC) ; port GPIO3_14
GPIO3_15: J1.29(GPIO3_15/NC) ; port GPIO3_15
GPIO3_27: J1.28(GPIO3_27/NC) ; port GPIO3_27
HSADC: J1.36(HSADC) ; port HSADC
I2C1_SCL: J1.119(I2C1_SCL) ; port I2C1_SCL
I2C1_SDA: J1.120(I2C1_SDA) ; port I2C1_SDA
I2S_BITCLK: J1.101(I2S_BITCLK) ; port I2S_BITCLK
I2S_LRCLK: J1.99(I2S_LRCLK) ; port I2S_LRCLK
I2S_MCLK: J1.100(I2S_MCLK) ; port I2S_MCLK
I2S_RXD: J1.97(I2S_RXD) ; port I2S_RXD
I2S_TXD: J1.98(I2S_TXD) ; port I2S_TXD
JTAG_RTCK: J1.19(JTAG_RTCK) ; port JTAG_RTCK
JTAG_TCK: J1.20(JTAG_TCK) ; port JTAG_TCK
JTAG_TDI: J1.22(JTAG_TDI) ; port JTAG_TDI
JTAG_TDO: J1.18(JTAG_TDO) ; port JTAG_TDO
JTAG_TMS: J1.21(JTAG_TMS) ; port JTAG_TMS
JTAG_TRST: J1.23(JTAG_TRST) ; port JTAG_nTRST  [project net JTAG_nTRST]
nRST_IN: J1.45(nRST_IN) ; port nRST_IN  [project net nRST]
nRST_OUT: J1.46(nRST_OUT) ; port nRST_OUT
PSWITCH: J1.42(PSWITCH) ; port PSWITCH
REG: J1.12(REG) ; port REG  [project net CLR_REG]
RUN: J1.14(RUN) ; port RUN
SD_CMD: J1.51(SD_CMD) ; port SD_CMD
SD_D0: J1.52(SD_D0)
SD_D1: J1.53(SD_D1)
SD_D2: J1.54(SD_D2)
SD_D3: J1.55(SD_D3)
SD_DETECT: J1.49(SD_DETECT) ; port SD_DETECT
SD_SCK: J1.50(SD_SCK) ; port SD_SCK  [project net SD_CLK]
SD_WP: J1.48(SD_WP) ; port SD_WP  [project net SD_nWP]
SPI2_MISO: J1.63(SPI2_MISO) ; port SPI2_MISO
SPI2_MOSI: J1.62(SPI2_MOSI) ; port SPI2_MOSI
SPI2_SCK: J1.61(SPI2_SCK) ; port SPI2_SCK
SPI2_SS0: J1.64(SPI2_SS0) ; port SPI2_SS0
SPI3_MISO: J1.67(SPI3_MISO/NC) ; port SPI3_MISO
SPI3_MOSI: J1.66(SPI3_MOSI/NC) ; port SPI3_MOSI
SPI3_SCK: J1.65(SPI3_SCK/NC) ; port SPI3_SCK
SPI3_SS0: J1.68(SPI3_SS0/NC) ; port SPI3_SS0
TFT_D0: J1.139(TFT_D0)
TFT_D1: J1.140(TFT_D1)
TFT_D2: J1.141(TFT_D2)
TFT_D3: J1.142(TFT_D3)
TFT_D4: J1.143(TFT_D4)
TFT_D5: J1.144(TFT_D5)
TFT_D6: J1.145(TFT_D6)
TFT_D7: J1.146(TFT_D7)
TFT_D8: J1.147(TFT_D8)
TFT_D9: J1.148(TFT_D9)
TFT_D10: J1.149(TFT_D10)
TFT_D11: J1.150(TFT_D11)
TFT_D12: J1.151(TFT_D12)
TFT_D13: J1.152(TFT_D13)
TFT_D14: J1.153(TFT_D14)
TFT_D15: J1.154(TFT_D15)
TFT_HSYNC: J1.137(TFT_HSYNC) ; port TFT_HSYNC
TFT_PWM: J1.132(TFT_PWM) ; port TFT_PWM
TFT_PWR: J1.133(TFT_PWR) ; port TFT_PWR  [project net TFT_nRST]
TFT_VCLK: J1.135(TFT_VCLK) ; port TFT_VCLK
TFT_VDEN: J1.136(TFT_VDEN) ; port TFT_VDEN
TFT_VSYNC: J1.138(TFT_VSYNC) ; port TFT_VSYNC
TS_XM: J1.127(TS_XM) ; port TS_XM
TS_XP: J1.128(TS_XP) ; port TS_XP
TS_YM: J1.129(TS_YM) ; port TS_YM
TS_YP: J1.130(TS_YP) ; port TS_YP
USB_H_N: J1.75(USB_H_N) ; port USB_H_N
USB_H_OC: J1.77(USB_H_OC) ; port USB_H_OC
USB_H_P: J1.76(USB_H_P) ; port USB_H_P
USB_OTG_ID: J1.74(USB_OTG_ID) ; port USB_OTG_ID
USB_OTG_N: J1.72(USB_OTG_N) ; port USB_OTG_N
USB_OTG_OC: J1.70(USB_OTG_OC) ; port USB_OTG_OC
USB_OTG_P: J1.73(USB_OTG_P) ; port USB_OTG_P
USB_OTG_PWR: J1.71(USB_OTG_PWR) ; port USB_OTG_PWR
WDO_EN: J1.43(WDO_EN) ; port WDO_EN

### Buses and harness runs
bus SD_D[0..3] = port SD_D[0..3]
bus TFT_D[0..15] = port TFT_D[0..15]

### Notes on the sheet
- (2) M283工控核心板
- i.MX287、i.MX286支持CAN0、CAN1
  i.MX283不支持
- i.MX287支持这4个GPIO
  i.MX283、i.MX286不支持
- i.MX287支持AUART3
  i.MX283、i.MX286不支持
- i.MX287支持AUART2
  i.MX283、i.MX286不支持
- i.MX287支持这些引脚
  i.MX286支持GPIO3_27
  i.MX283不支持这些引脚
- i.MX287支持2路以太网(RMII)
  i.MX283、i.MX286支持1路（ENET0），其余引脚悬空
- i.MX287支持SPI3
  i.MX283、i.MX286不支持
- 1
- #
- 修改日期
- 修改内容
- 2
- 3
- 广州致远电子股份有限公司
- 设计人员
- 审核人员
- 设计日期
- 审核日期
- 产品名称
- 图纸名称
- 产品型号
- 图纸描述
- 图纸版本
- A3
- (in symbol M283-PACK) LCD; CAN; I2C; PWR & SYS; UART; JTAG; M283_PACK; SAIF; GPIO; ADC; ENET; SD Card; SPI; USB

### Library data of the parts
J1 = M283-PACK: M283

## Sheet 05. UART.SchDoc
size A4; CheckedBy: 黄钦宁; Author: 陈坤; DocumentNumber: 5; SheetNumber: 5; SheetTotal: 13; PageSetup: Record=PageOptions|CenterHorizontal=True|CenterVertical=True|PrintScale=1.00|XCorrection=1.00|YCorrection=1.00|PrintKind=0|BorderSize=5000000|LeftOffset=0|BottomOffset=0|Orientation=2|PaperLength=1000|PaperWidth=1000|Scale=100|PaperSource=7|PrintQuality=600|MediaType=1|DitherType=10|PaperKind=A4|PrintScaleMode=1; DesignDate: 2013-08-16; CheckDate: 2013-12-28; SheetName: UART; SheetVersion: V1.00; SheetDescription: 调试串口和应用串口; ProductName: EasyARM-iMX28学习套件; ProductModel: EasyARM-iMX283
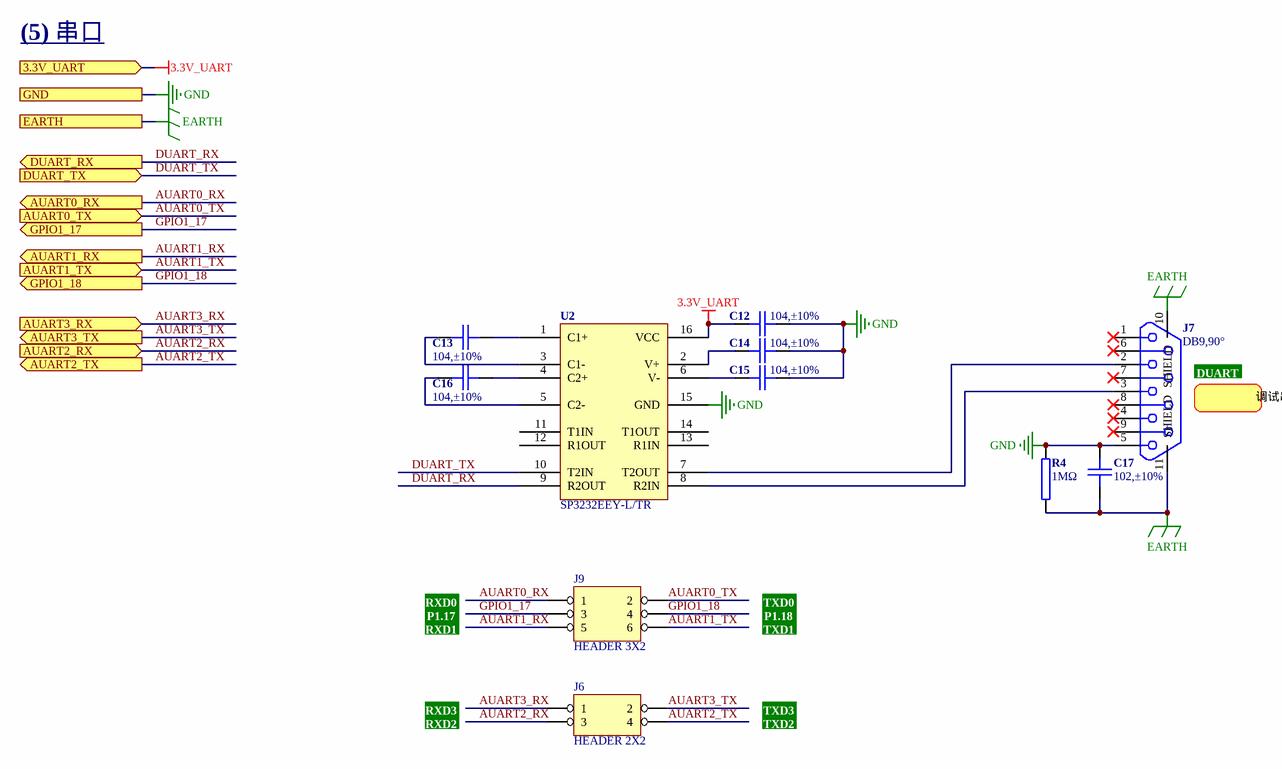
[diagram p2: 05. UART.SchDoc]

### Parts
C12  104,±10%  [0603C]
C13  104,±10%  [0603C]
C14  104,±10%  [0603C]
C15  104,±10%  [0603C]
C16  104,±10%  [0603C]
C17  102,±10%  [1206C]
J6  HEADER 2X2  [IDC-4]
J7  value DB9,90°  [DB-9RA/F]  (hidden comment: DB9)
J9  HEADER 3X2  [IDC-6]
R4  1MΩ  [1206R]
U2  value SP3232EEY-L/TR  [SOP65P640X120-16N]  (hidden comment: SP3232E)

### Ports
3.3V_UART, AUART0_RX (out), AUART0_TX (in), AUART1_RX (out), AUART1_TX (in), AUART2_RX (in), AUART2_TX (out), AUART3_RX (in), AUART3_TX (out), DUART_RX (out), DUART_TX (in), EARTH, GND, GPIO1_17 (out), GPIO1_18 (out)

### Nets
3.3V_UART: C12.1 U2.16(VCC) ; port 3.3V_UART  [project net 3.3V]
EARTH: C17.2 J7.10(SHIELD) J7.11(SHIELD) R4.1 ; port EARTH
GND: C12.2 C14.2 C15.2 C17.1 J7.5 R4.2 U2.15(GND) ; port GND
AUART0_RX: J9.1 ; port AUART0_RX
AUART0_TX: J9.2 ; port AUART0_TX
AUART1_RX: J9.5 ; port AUART1_RX
AUART1_TX: J9.6 ; port AUART1_TX
AUART2_RX: J6.3 ; port AUART2_RX
AUART2_TX: J6.4 ; port AUART2_TX
AUART3_RX: J6.1 ; port AUART3_RX
AUART3_TX: J6.2 ; port AUART3_TX
DUART_RX: U2.9(R2OUT) ; port DUART_RX
DUART_TX: U2.10(T2IN) ; port DUART_TX
GPIO1_17: J9.3 ; port GPIO1_17
GPIO1_18: J9.4 ; port GPIO1_18
NetC13_1: C13.1 U2.3(C1-)
NetC13_2: C13.2 U2.1(C1+)
NetC14_1: C14.1 U2.2(V+)
NetC15_1: C15.1 U2.6(V-)
NetC16_1: C16.1 U2.5(C2-)
NetC16_2: C16.2 U2.4(C2+)
NetJ7_2: J7.2 U2.7(T2OUT)
NetJ7_3: J7.3 U2.8(R2IN)

Not connected (* = marked no-connect by the designer): J7 1* 4* 6* 7* 8* 9*; U2 11(T1IN) 12(R1OUT) 13(R1IN) 14(T1OUT)

### Notes on the sheet
- (5) 串口
- (near J7) DUART
- 调试串口
- RXD0
- P1.17
- RXD1
- TXD0
- P1.18
- TXD1
- RXD3
- RXD2
- TXD3
- TXD2
- 1
- #
- 修改日期
- 修改内容
- 2
- 3
- 广州致远电子股份有限公司
- 设计人员
- 审核人员
- 设计日期
- 审核日期
- 产品名称
- 图纸名称
- 产品型号
- 图纸描述
- 图纸版本
- A4

### Library data of the parts
C12-C16 = 1.02.01.0032: 104,±10%,50V,X7R,0603,*,RoHS; 名称: 电容; 封装: 0603; 设备封装名称: C0603_104_X7R_50V_10%; 贴片和直插: SMT; 物料代码: 1.02.01.0032; Value: 104,±10%; RoHS: RoHS; 型号: 104,±10%,50V,X7R; ComponentLink1Description: ErpDataInfo; ComponentLink1URL: http://erp.zlgmcu.com/ErpExt/ErpData/ListMateriel.aspx?pkey=1.02.01.0032
C17 = 1.02.03.0003: 102,±10%,2KV,X7R,1206,*,RoHS; 名称: 电容; 封装: 1206; 设备封装名称: C1206_102_X7R_2KV_10%; 贴片和直插: SMT; 物料代码: 1.02.03.0003; Value: 102,±10%; RoHS: RoHS; 型号: 102,±10%,2KV,X7R; ComponentLink1Description: ErpDataInfo; ComponentLink1URL: http://erp.zlgmcu.com/ErpExt/ErpData/ListMateriel.aspx?pkey=1.02.03.0003
J7 = 1.10.05.0014: DB9,90°,孔,铆合,带螺丝; 名称: 串口座; 贴片和直插: THT; 物料代码: 1.10.05.0014; 型号: DB9,90°,孔,铆合,带螺丝; ComponentLink1Description: ErpDataInfo; ComponentLink1URL: http://erp.zlgmcu.com/ErpExt/ErpData/ListMateriel.aspx?pkey=1.10.05.0014
R4 = 1.01.03.0019: 1MΩ,1206,RoHS; 名称: 电阻; 封装: 1206; 设备封装名称: R1206_1M; 贴片和直插: SMT; 物料代码: 1.01.03.0019; Value: 1MΩ; RoHS: RoHS; 型号: 1MΩ; ComponentLink1Description: ErpDataInfo; ComponentLink1URL: http://erp.zlgmcu.com/ErpExt/ErpData/ListMateriel.aspx?pkey=1.01.03.0019
U2 = 1.05.08.0024: SP3232EEY-L/TR,TSSOP-16,EXAR,RoHS; 名称: IC; 设备封装名称: TSSOP-16_SP3232EEY-L/TR; 贴片和直插: SMT; 物料代码: 1.05.08.0024; 封装: TSSOP-16; 厂商: EXAR; RoHS: RoHS; 型号: SP3232EEY-L/TR; ComponentLink1Description: ErpDataInfo; ComponentLink1URL: http://erp.zlgmcu.com/ErpExt/ErpData/ListMateriel.aspx?pkey=1.05.08.0024

## Sheet 07. USB OTG.SchDoc
size A4; CheckedBy: 黄钦宁; Author: 陈坤; DocumentNumber: 7; SheetNumber: 7; SheetTotal: 13; PageSetup: Record=PageOptions|CenterHorizontal=True|CenterVertical=True|PrintScale=1.00|XCorrection=1.00|YCorrection=1.00|PrintKind=0|BorderSize=5000000|LeftOffset=0|BottomOffset=0|Orientation=2|PaperLength=1000|PaperWidth=1000|Scale=100|PaperSource=7|PrintQuality=600|MediaType=1|DitherType=10|PaperKind=A4|PrintScaleMode=1; DesignDate: 2013-08-16; CheckDate: 2013-12-28; SheetName: USB_OTG; SheetVersion: V1.00; SheetDescription: USB_OTG接口; ProductName: EasyARM-iMX28学习套件; ProductModel: EasyARM-iMX283
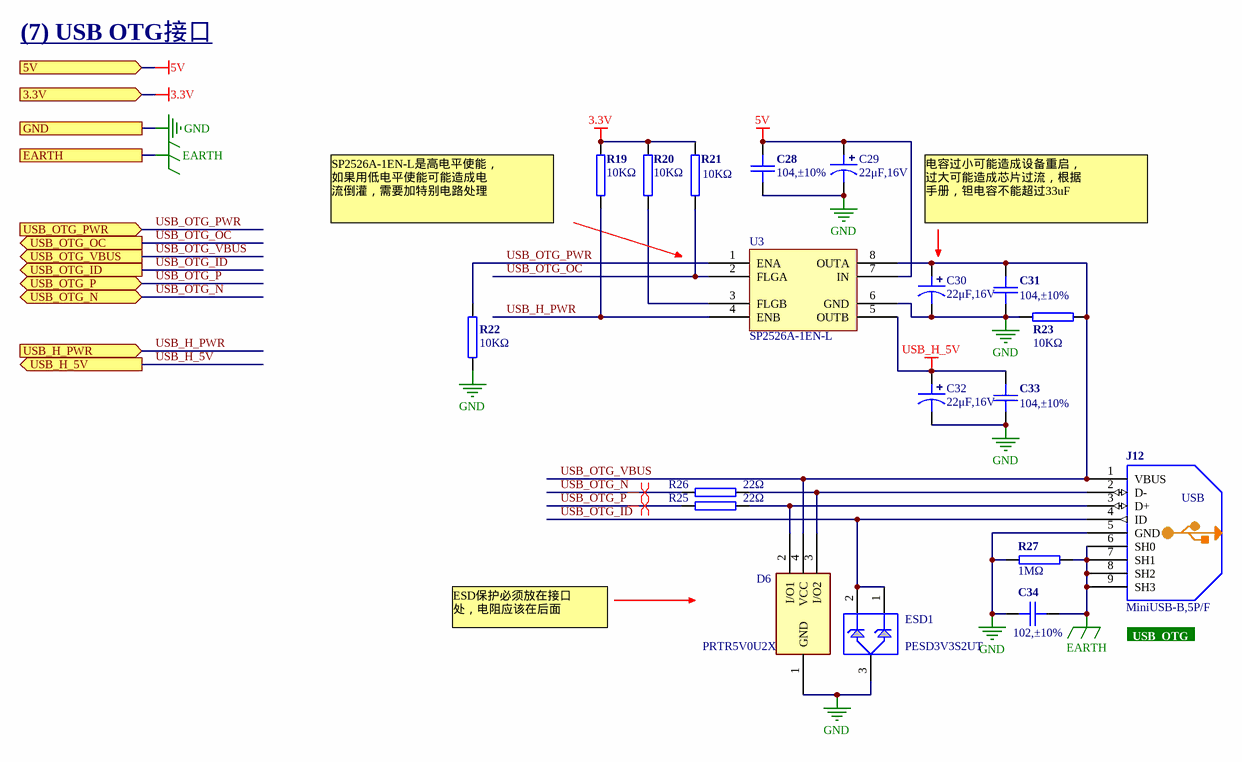
[diagram p3: 07. USB OTG.SchDoc]

### Parts
C28  104,±10%  [0603C]
C29  22μF,16V  [CAP-B]
C30  22μF,16V  [CAP-B]
C31  104,±10%  [0603C]
C32  22μF,16V  [CAP-B]
C33  104,±10%  [0603C]
C34  102,±10%  [1206C]
D6  PRTR5V0U2X  [SOT-143]
ESD1  value PESD3V3S2UT  [SOT-23]  (hidden comment: ESD-3)
J12  value MiniUSB-B,5P/F  [USB_MINIB_SMT]  (hidden comment: USB_MINIB_SMT)
R19  10KΩ  [0603R]
R20  10KΩ  [0603R]
R21  10KΩ  [0603R]
R22  10KΩ  [0603R]
R23  10KΩ  [0603R]
R25  22Ω  [0603R]
R26  22Ω  [0603R]
R27  1MΩ  [1206R]
U3  value SP2526A-1EN-L  [SOIC127P600X175-8N]  (hidden comment: SP2526A)

### Ports
3.3V (in), 5V, EARTH, GND, USB_H_5V (out), USB_H_PWR (in), USB_OTG_ID (out), USB_OTG_N (bidir), USB_OTG_OC (out), USB_OTG_P (bidir), USB_OTG_PWR (in), USB_OTG_VBUS (out)

### Nets
3.3V: R19.2 R20.2 R21.2 ; port 3.3V
5V: C28.1 C29.1 U3.7(IN) ; port 5V
EARTH: C34.2 J12.6(SH0) J12.7(SH1) J12.8(SH2) J12.9(SH3) R27.2 ; port EARTH
GND: C28.2 C29.2 C30.2 C31.1 C32.2 C33.1 C34.1 D6.1(GND) ESD1.3 J12.5(GND) R22.1 R23.2 R27.1 U3.6(GND) ; port GND
USB_H_5V: C32.1 C33.2 U3.5(OUTB) ; port USB_H_5V
USB_H_PWR: R19.1 U3.4(ENB) ; port USB_H_PWR  [project net USB_H_OC]
USB_OTG_ID: ESD1.1 ESD1.2 J12.4(ID) ; port USB_OTG_ID
USB_OTG_N: R26.2 ; port USB_OTG_N
USB_OTG_OC: R21.1 U3.2(FLGA) ; port USB_OTG_OC
USB_OTG_P: R25.2 ; port USB_OTG_P
USB_OTG_PWR: R22.2 U3.1(ENA) ; port USB_OTG_PWR
USB_OTG_VBUS: C30.1 C31.2 D6.4(VCC) J12.1(VBUS) R23.1 U3.8(OUTA) ; port USB_OTG_VBUS
NetD6_2: D6.2(I/O1) J12.3(D+) R25.1
NetD6_3: D6.3(I/O2) J12.2(D-) R26.1
NetR20_1: R20.1 U3.3(FLGB)

### Layout directives
differential pair: USB_OTG_N, USB_OTG_P

### Notes on the sheet
- (7) USB OTG接口
- (near R19) SP2526A-1EN-L是高电平使能，
  如果用低电平使能可能造成电
  流倒灌，需要加特别电路处理
- 电容过小可能造成设备重启，
  过大可能造成芯片过流，根据
  手册，钽电容不能超过33uF
- ESD保护必须放在接口
  处，电阻应该在后面
- (near J12) USB_OTG
- 1
- #
- 修改日期
- 修改内容
- 2
- 3
- 广州致远电子股份有限公司
- 设计人员
- 审核人员
- 设计日期
- 审核日期
- 产品名称
- 图纸名称
- 产品型号
- 图纸描述
- 图纸版本
- A4
- (in symbol 1.10.05.0024) USB

### Library data of the parts
C28 = 1.02.01.0032: Capacitor; 名称: 电容; 规格型号: 104,±10%,50V,X7R,0603,*,RoHS; 贴片和直插: SMT; 现有库存: 1717054; 封装: 0603; 设备封装名称: C0603_104_X7R_50V_10%; 物料代码: 1.02.01.0032; Value: 104,±10%; RoHS: RoHS; ComponentLink1Description: ErpDataInfo; ComponentLink1URL: http://erp.zlgmcu.com/ErpExt/ErpData/ListMateriel.aspx?pkey=1.02.01.0032
C29 C30 C32 = 1.02.05.0015: 22μF,16V,B型,,AVX,RoHS; 名称: 钽电容; 设备封装名称: B_22uF_16V; 贴片和直插: SMT; 器件优选方案: 优先选用; 物料代码: 1.02.05.0015; Value: 22μF,16V; 厂商: AVX; RoHS: RoHS; 型号: 22μF,16V,B型; ComponentLink1Description: ErpDataInfo; ComponentLink1URL: http://erp.zlgmcu.com/ErpExt/ErpData/ListMateriel.aspx?pkey=1.02.05.0015
C31 C33 = 1.02.01.0032: Capacitor; 名称: 电容; 规格型号: 104,±10%,50V,X7R,0603,*,RoHS; 封装: 0603; 设备封装名称: C0603_104_X7R_50V_10%; 贴片和直插: SMT; 现有库存: 1717054; 物料代码: 1.02.01.0032; Value: 104,±10%; RoHS: RoHS; ComponentLink1Description: ErpDataInfo; ComponentLink1URL: http://erp.zlgmcu.com/ErpExt/ErpData/ListMateriel.aspx?pkey=1.02.01.0032
C34 = 1.02.03.0003: Capacitor; 名称: 电容; 规格型号: 102,±10%,2KV,X7R,1206,*,RoHS; 封装: 1206; 设备封装名称: C1206_102_X7R_2KV_10%; 贴片和直插: SMT; 现有库存: 26517; 物料代码: 1.02.03.0003; Value: 102,±10%; RoHS: RoHS; ComponentLink1Description: ErpDataInfo; ComponentLink1URL: http://erp.zlgmcu.com/ErpExt/ErpData/ListMateriel.aspx?pkey=1.02.03.0003
D6 = 1.05.10.0153: PRTR5V0U2X,SOT-143B,NXP,RoHS; 名称: IC; 设备封装名称: SOT-143B_PRTR5V0U2X; 贴片和直插: SMT; 物料代码: 1.05.10.0153; Value: PRTR5V0U2X; 封装: SOT-143B; 厂商: NXP; RoHS: RoHS; 型号: PRTR5V0U2X; ComponentLink1Description: ErpDataInfo; ComponentLink1URL: http://erp.zlgmcu.com/ErpExt/ErpData/ListMateriel.aspx?pkey=1.05.10.0153
ESD1 = 1.05.10.0361: PESD3V3S2UT,SOT-23,NXP,RoHS; 名称: IC; 设备封装名称: SOT-23_PESD3V3S2UT; 贴片和直插: SMT; 物料代码: 1.05.10.0361; 封装: SOT-23; 厂商: NXP; RoHS: RoHS; 型号: PESD3V3S2UT; ComponentLink1Description: ErpDataInfo; ComponentLink1URL: http://erp.zlgmcu.com/ErpExt/ErpData/ListMateriel.aspx?pkey=1.05.10.0361
J12 = 1.10.05.0024: MiniUSB-B,5P/F,7.6×9×4,SMD,RoHS; Text Field1: 100; Text Field2: 80; 名称: USB插座; 贴片和直插: SMT; 物料代码: 1.10.05.0024; RoHS: RoHS; 型号: MiniUSB-B,5P/F,7.6×9×4,SMD; ComponentLink1Description: ErpDataInfo; ComponentLink1URL: http://erp.zlgmcu.com/ErpExt/ErpData/ListMateriel.aspx?pkey=1.10.05.0024
R19-R22 = 1.01.01.0051: 名称: 电阻; 规格型号: 10KΩ,0603,*,RoHS; 封装: 0603; 设备封装名称: R0603_10K; 贴片和直插: SMT; 现有库存: 693985; 物料代码: 1.01.01.0051; Value: 10KΩ; RoHS: RoHS; ComponentLink1Description: ErpDataInfo; ComponentLink1URL: http://erp.zlgmcu.com/ErpExt/ErpData/ListMateriel.aspx?pkey=1.01.01.0051
R23 = 1.01.01.0051: 10KΩ,0603,*,RoHS; 名称: 电阻; 封装: 0603; 设备封装名称: R0603_10K; 贴片和直插: SMT; 物料代码: 1.01.01.0051; Value: 10KΩ; RoHS: RoHS; 型号: 10KΩ; ComponentLink1Description: ErpDataInfo; ComponentLink1URL: http://erp.zlgmcu.com/ErpExt/ErpData/ListMateriel.aspx?pkey=1.01.01.0051
R25 R26 = 1.01.01.0014: 名称: 电阻; 规格型号: 22Ω,0603,*,RoHS; 现有库存: 99098; 物料代码: 1.01.01.0014; Value: 22Ω; ComponentLink1Description: ErpDataInfo; ComponentLink1URL: http://192.168.0.2:8012/ErpExt/ErpData/ListMateriel.aspx?pkey=1.01.01.0014
R27 = 1.01.03.0019: 名称: 电阻; 规格型号: 1MΩ,1206,RoHS; 封装: 1206; 设备封装名称: R1206_1M; 贴片和直插: SMT; 现有库存: 12252; 物料代码: 1.01.03.0019; Value: 1MΩ; RoHS: RoHS; ComponentLink1Description: ErpDataInfo; ComponentLink1URL: http://erp.zlgmcu.com/ErpExt/ErpData/ListMateriel.aspx?pkey=1.01.03.0019
U3 = 1.05.09.0064: SP2526A-1EN-L,SO-8,EXAR,RoHS; 名称: IC; 设备封装名称: SO-8_SP2526A-1EN-L; 贴片和直插: SMT; 物料代码: 1.05.09.0064; 封装: SO-8; 厂商: EXAR; RoHS: RoHS; 型号: SP2526A-1EN-L; ComponentLink1Description: ErpDataInfo; ComponentLink1URL: http://erp.zlgmcu.com/ErpExt/ErpData/ListMateriel.aspx?pkey=1.05.09.0064

## Sheet 06. USB HOST.SchDoc
size A4; CheckedBy: 黄钦宁; Author: 陈坤; DocumentNumber: 6; SheetNumber: 6; SheetTotal: 13; PageSetup: Record=PageOptions|CenterHorizontal=True|CenterVertical=True|PrintScale=1.00|XCorrection=1.00|YCorrection=1.00|PrintKind=0|BorderSize=5000000|LeftOffset=0|BottomOffset=0|Orientation=2|PaperLength=1000|PaperWidth=1000|Scale=100|PaperSource=7|PrintQuality=600|MediaType=1|DitherType=10|PaperKind=A4|PrintScaleMode=1; DesignDate: 2013-08-16; CheckDate: 2013-12-28; SheetName: USB_HOST; SheetVersion: V1.00; SheetDescription: USB_HOST接口; ProductName: EasyARM-iMX28学习套件; ProductModel: EasyARM-iMX283
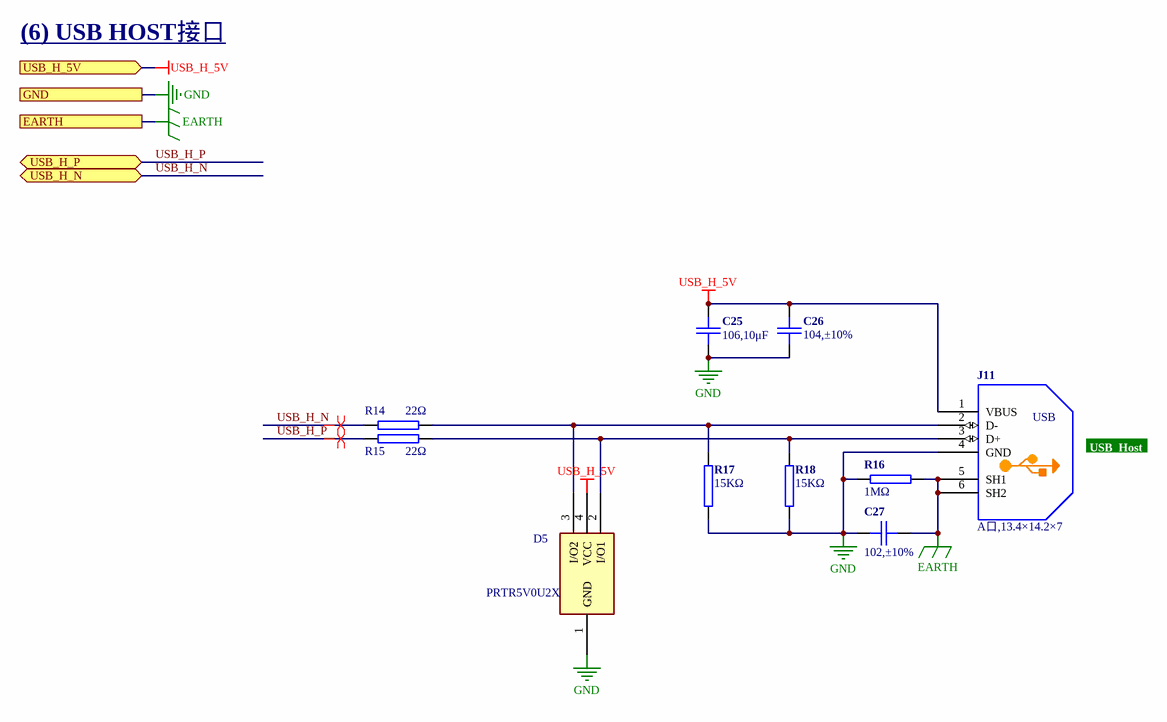
[diagram p4: 06. USB HOST.SchDoc]

### Parts
C25  106,10μF  [0805C]
C26  104,±10%  [0603C]
C27  102,±10%  [1206C]
D5  PRTR5V0U2X  [SOT-143]
J11  value A口,13.4×14.2×7  [USB-A]  (hidden comment: USB)
R14  22Ω  [0603R]
R15  22Ω  [0603R]
R16  1MΩ  [1206R]
R17  15KΩ  [0603R]
R18  15KΩ  [0603R]

### Ports
EARTH, GND, USB_H_5V, USB_H_N (bidir), USB_H_P (bidir)

### Nets
EARTH: C27.2 J11.5(SH1) J11.6(SH2) R16.2 ; port EARTH
GND: C25.2 C26.2 C27.1 D5.1(GND) J11.4(GND) R16.1 R17.1 R18.1 ; port GND
USB_H_5V: C25.1 C26.1 D5.4(VCC) J11.1(VBUS) ; port USB_H_5V
USB_H_N: R14.2 ; port USB_H_N
USB_H_P: R15.2 ; port USB_H_P
NetD5_2: D5.2(I/O1) J11.3(D+) R15.1 R18.2
NetD5_3: D5.3(I/O2) J11.2(D-) R14.1 R17.2

### Layout directives
differential pair: USB_H_N, USB_H_P

### Notes on the sheet
- (6) USB HOST接口
- USB_Host
- 1
- #
- 修改日期
- 修改内容
- 2
- 3
- 广州致远电子股份有限公司
- 设计人员
- 审核人员
- 设计日期
- 审核日期
- 产品名称
- 图纸名称
- 产品型号
- 图纸描述
- 图纸版本
- A4

### Library data of the parts
C25 = 1.02.02.0055: Capacitor; 名称: 电容; 规格型号: 106,10μF,±10%,10V,X5R,0805,RoHS; 封装: 0805; 设备封装名称: C0805_106_X5R_10V_10%; 贴片和直插: SMT; 现有库存: 36878; 物料代码: 1.02.02.0055; Value: 106,10μF; RoHS: RoHS; ComponentLink1Description: ErpDataInfo; ComponentLink1URL: http://erp.zlgmcu.com/ErpExt/ErpData/ListMateriel.aspx?pkey=1.02.02.0055
C26 = 1.02.01.0032: as C28 on sheet 07. USB OTG; 物料代码: 1.02.01.0032; Value: 104,±10%; RoHS: RoHS; ComponentLink1Description: ErpDataInfo; ComponentLink1URL: http://erp.zlgmcu.com/ErpExt/ErpData/ListMateriel.aspx?pkey=1.02.01.0032
C27 = 1.02.03.0003: as C34 on sheet 07. USB OTG; 物料代码: 1.02.03.0003; Value: 102,±10%; RoHS: RoHS; ComponentLink1Description: ErpDataInfo; ComponentLink1URL: http://erp.zlgmcu.com/ErpExt/ErpData/ListMateriel.aspx?pkey=1.02.03.0003
D5 = 1.05.10.0153: as D6 on sheet 07. USB OTG; 物料代码: 1.05.10.0153; Value: PRTR5V0U2X; 封装: SOT-143B; 厂商: NXP; RoHS: RoHS; 型号: PRTR5V0U2X; ComponentLink1Description: ErpDataInfo; ComponentLink1URL: http://erp.zlgmcu.com/ErpExt/ErpData/ListMateriel.aspx?pkey=1.05.10.0153
J11 = 1.10.05.0008: A口,13.4×14.2×7,90°,RoHS; Text Field1: 50; Text Field2: 60; 名称: USB插座; 贴片和直插: THT; 物料代码: 1.10.05.0008; RoHS: RoHS; 型号: A口,13.4×14.2×7,90°; ComponentLink1Description: ErpDataInfo; ComponentLink1URL: http://erp.zlgmcu.com/ErpExt/ErpData/ListMateriel.aspx?pkey=1.10.05.0008
R14 R15 = 1.01.01.0014: as R25 on sheet 07. USB OTG; 物料代码: 1.01.01.0014; Value: 22Ω; ComponentLink1Description: ErpDataInfo; ComponentLink1URL: http://192.168.0.2:8012/ErpExt/ErpData/ListMateriel.aspx?pkey=1.01.01.0014
R16 = 1.01.03.0019: as R27 on sheet 07. USB OTG; 物料代码: 1.01.03.0019; Value: 1MΩ; RoHS: RoHS; ComponentLink1Description: ErpDataInfo; ComponentLink1URL: http://erp.zlgmcu.com/ErpExt/ErpData/ListMateriel.aspx?pkey=1.01.03.0019
R17 R18 = 1.01.01.0054: 名称: 电阻; 规格型号: 15KΩ,0603,*,RoHS; 贴片和直插: SMT; 现有库存: 45635; 封装: 0603; 设备封装名称: R0603_15K; 物料代码: 1.01.01.0054; Value: 15KΩ; RoHS: RoHS; ComponentLink1Description: ErpDataInfo; ComponentLink1URL: http://erp.zlgmcu.com/ErpExt/ErpData/ListMateriel.aspx?pkey=1.01.01.0054

## Sheet 09. NET_Interface.SchDoc
size A4; CheckedBy: 黄钦宁; Author: 陈坤; DocumentNumber: 9; SheetNumber: 9; SheetTotal: 13; PageSetup: Record=PageOptions|CenterHorizontal=True|CenterVertical=True|PrintScale=1.00|XCorrection=1.00|YCorrection=1.00|PrintKind=0|BorderSize=5000000|LeftOffset=0|BottomOffset=0|Orientation=2|PaperLength=1000|PaperWidth=1000|Scale=100|PaperSource=7|PrintQuality=600|MediaType=1|DitherType=10|PaperKind=A4|PrintScaleMode=1; DesignDate: 2013-08-16; CheckDate: 2013-12-28; SheetName: NET_Interface; SheetVersion: V1.00; SheetDescription: NET_Interface; ProductName: EasyARM-iMX28学习套件; ProductModel: EasyARM-iMX283
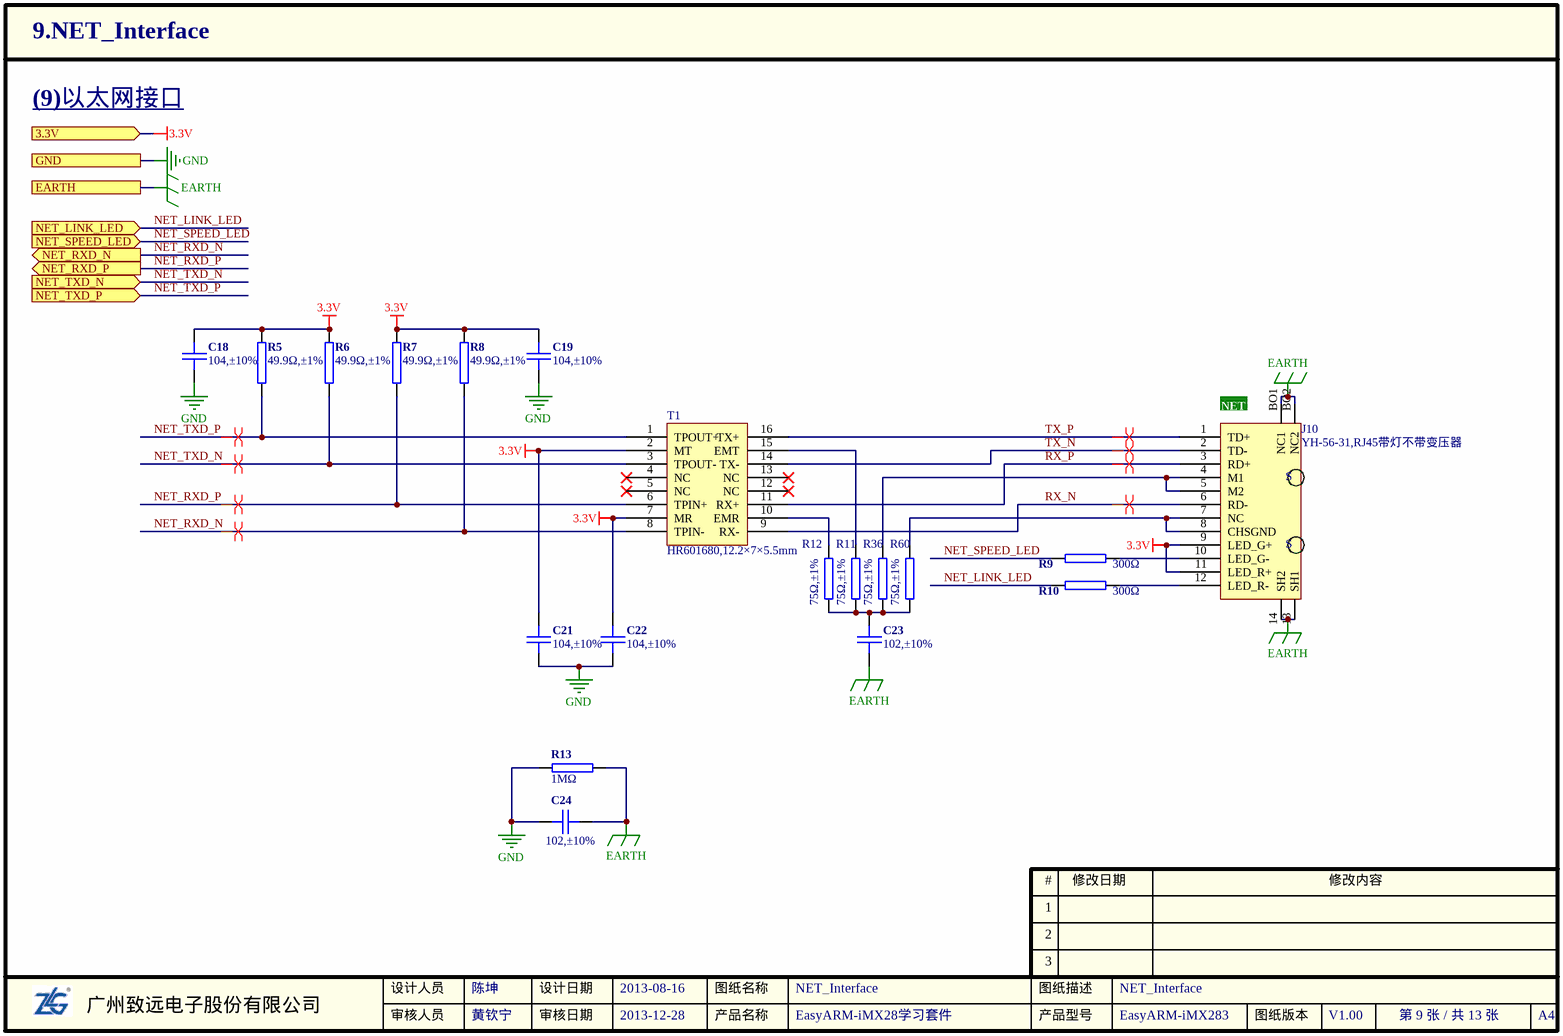
[diagram p5: 09. NET_Interface.SchDoc]

### Parts
C18  104,±10%  [0603C]
C19  104,±10%  [0603C]
C21  104,±10%  [0603C]
C22  104,±10%  [0603C]
C23  102,±10%  [1206C]
C24  102,±10%  [1206C]
J10  value YH-56-31,RJ45带灯不带变压器  [RJ45/LED]  (hidden comment: HR911105C)
R5  49.9Ω,±1%  [0603R]
R6  49.9Ω,±1%  [0603R]
R7  49.9Ω,±1%  [0603R]
R8  49.9Ω,±1%  [0603R]
R9  300Ω  [0603R]
R10  300Ω  [0603R]
R11  75Ω,±1%  [0603R]
R12  75Ω,±1%  [0603R]
R13  1MΩ  [1206R]
R36  75Ω,±1%  [0603R]
R60  75Ω,±1%  [0603R]
T1  value HR601680,12.2×7×5.5mm  [TRAN16-12R2X7X5R5-SM]  (hidden comment: HR601680)

### Ports
3.3V, EARTH, GND, NET_LINK_LED (in), NET_RXD_N (out), NET_RXD_P (out), NET_SPEED_LED (in), NET_TXD_N (in), NET_TXD_P (in)

### Nets
3.3V: C18.1 C19.1 C21.1 C22.1 J10.9(LED_G+) J10.11(LED_R+) R5.1 R6.1 R7.2 R8.1 T1.2(MT) T1.7(MR) ; port 3.3V
EARTH: C23.2 C24.2 J10.13(SH1) J10.14(SH2) J10.BO1(NC1) J10.BO2(NC2) R13.2 ; port EARTH
GND: C18.2 C19.2 C21.2 C22.2 C24.1 R13.1 ; port GND
NET_LINK_LED: R10.1 ; port NET_LINK_LED
NET_RXD_N: R8.2 T1.8(TPIN-) ; port NET_RXD_N
NET_RXD_P: R7.1 T1.6(TPIN+) ; port NET_RXD_P
NET_SPEED_LED: R9.1 ; port NET_SPEED_LED
NET_TXD_N: R6.2 T1.3(TPOUT-) ; port NET_TXD_N
NET_TXD_P: R5.2 T1.1(TPOUT+) ; port NET_TXD_P
RX_N: J10.6(RD-) T1.9(RX-)
RX_P: J10.3(RD+) T1.11(RX+)
TX_N: J10.2(TD-) T1.14(TX-)
TX_P: J10.1(TD+) T1.16(TX+)
NetC23_1: C23.1 R11.1 R12.1 R36.1 R60.1
NetJ10_4: J10.4(M1) J10.5(M2) R36.2
NetJ10_7: J10.7(NC) J10.8(CHSGND) R60.2
NetJ10_10: J10.10(LED_G-) R9.2
NetJ10_12: J10.12(LED_R-) R10.2
NetR11_2: R11.2 T1.15(EMT)
NetR12_2: R12.2 T1.10(EMR)

Not connected (* = marked no-connect by the designer): T1 4(NC)* 5(NC)* 12(NC)* 13(NC)*

### Layout directives
differential pair: NET_RXD_N, NET_RXD_P, NET_TXD_N, NET_TXD_P, RX_N, RX_P, TX_N, TX_P

### Notes on the sheet
- (9)以太网接口
- (near J10) NET
- 1
- #
- 修改日期
- 修改内容
- 2
- 3
- 广州致远电子股份有限公司
- 设计人员
- 审核人员
- 设计日期
- 审核日期
- 产品名称
- 图纸名称
- 产品型号
- 图纸描述
- 图纸版本
- A4
- (in symbol 1.10.05.0062) S

### Library data of the parts
C18 C19 C21 C22 = 1.02.01.0032: as C12 on sheet 05. UART; 物料代码: 1.02.01.0032; Value: 104,±10%; RoHS: RoHS; 型号: 104,±10%,50V,X7R; ComponentLink1Description: ErpDataInfo; ComponentLink1URL: http://erp.zlgmcu.com/ErpExt/ErpData/ListMateriel.aspx?pkey=1.02.01.0032
C23 = 1.02.03.0003: as C17 on sheet 05. UART; 物料代码: 1.02.03.0003; Value: 102,±10%; RoHS: RoHS; 型号: 102,±10%,2KV,X7R; ComponentLink1Description: ErpDataInfo; ComponentLink1URL: http://erp.zlgmcu.com/ErpExt/ErpData/ListMateriel.aspx?pkey=1.02.03.0003
C24 = 1.02.03.0003: as C34 on sheet 07. USB OTG; 物料代码: 1.02.03.0003; Value: 102,±10%; RoHS: RoHS; ComponentLink1Description: ErpDataInfo; ComponentLink1URL: http://erp.zlgmcu.com/ErpExt/ErpData/ListMateriel.aspx?pkey=1.02.03.0003
J10 = 1.10.05.0062: YH-56-31,RJ45带灯不带变压器; 名称: 网线插座; 贴片和直插: THT; 物料代码: 1.10.05.0062; 型号: YH-56-31,RJ45带灯不带变压器; ComponentLink1Description: ErpDataInfo; ComponentLink1URL: http://erp.zlgmcu.com/ErpExt/ErpData/ListMateriel.aspx?pkey=1.10.05.0062
R5-R8 = 1.01.01.0018: 49.9Ω,±1%,0603,*,RoHS; 名称: 电阻; 封装: 0603; 设备封装名称: R0603_49.9R_1%; 贴片和直插: SMT; 物料代码: 1.01.01.0018; Value: 49.9Ω,±1%; RoHS: RoHS; 型号: 49.9Ω,±1%; ComponentLink1Description: ErpDataInfo; ComponentLink1URL: http://erp.zlgmcu.com/ErpExt/ErpData/ListMateriel.aspx?pkey=1.01.01.0018
R9 R10 = 1.01.01.0030: 300Ω,0603,*,RoHS; 名称: 电阻; 封装: 0603; 设备封装名称: R0603_300R; 贴片和直插: SMT; 物料代码: 1.01.01.0030; Value: 300Ω; RoHS: RoHS; 型号: 300Ω; ComponentLink1Description: ErpDataInfo; ComponentLink1URL: http://erp.zlgmcu.com/ErpExt/ErpData/ListMateriel.aspx?pkey=1.01.01.0030
R11 R12 R36 R60 = 1.01.01.0021: 75Ω,±1%,0603,*,RoHS; 名称: 电阻; 封装: 0603; 设备封装名称: R0603_75R_1%; 贴片和直插: SMT; 物料代码: 1.01.01.0021; Value: 75Ω,±1%; RoHS: RoHS; 型号: 75Ω,±1%; ComponentLink1Description: ErpDataInfo; ComponentLink1URL: http://erp.zlgmcu.com/ErpExt/ErpData/ListMateriel.aspx?pkey=1.01.01.0021
R13 = 1.01.03.0019: as R27 on sheet 07. USB OTG; 物料代码: 1.01.03.0019; Value: 1MΩ; RoHS: RoHS; ComponentLink1Description: ErpDataInfo; ComponentLink1URL: http://erp.zlgmcu.com/ErpExt/ErpData/ListMateriel.aspx?pkey=1.01.03.0019
T1 = 1.06.06.0002: HR601680,12.2×7×5.5mm,SOP-16,RoHS; 名称: 网络变压器; 设备封装名称: SOP-16_HR601680_12.2x7x5.5; 贴片和直插: SMT; 物料代码: 1.06.06.0002; 封装: SOP-16; RoHS: RoHS; 型号: HR601680,12.2×7×5.5mm; ComponentLink1Description: ErpDataInfo; ComponentLink1URL: http://erp.zlgmcu.com/ErpExt/ErpData/ListMateriel.aspx?pkey=1.06.06.0002

## Sheet 08. NET_DP83848K.SchDoc
size A4; CheckedBy: 黄钦宁; Author: 陈坤; DocumentNumber: 8; SheetNumber: 8; SheetTotal: 13; PageSetup: Record=PageOptions|CenterHorizontal=True|CenterVertical=True|PrintScale=1.00|XCorrection=1.00|YCorrection=1.00|PrintKind=0|BorderSize=5000000|LeftOffset=0|BottomOffset=0|Orientation=2|PaperLength=1000|PaperWidth=1000|Scale=100|PaperSource=7|PrintQuality=600|MediaType=1|DitherType=10|PaperKind=A4|PrintScaleMode=1; DesignDate: 2013-08-16; CheckDate: 2013-12-28; SheetName: NET; SheetVersion: V1.00; SheetDescription: NET DP83848K; ProductName: EasyARM-iMX28学习套件; ProductModel: EasyARM-iMX283
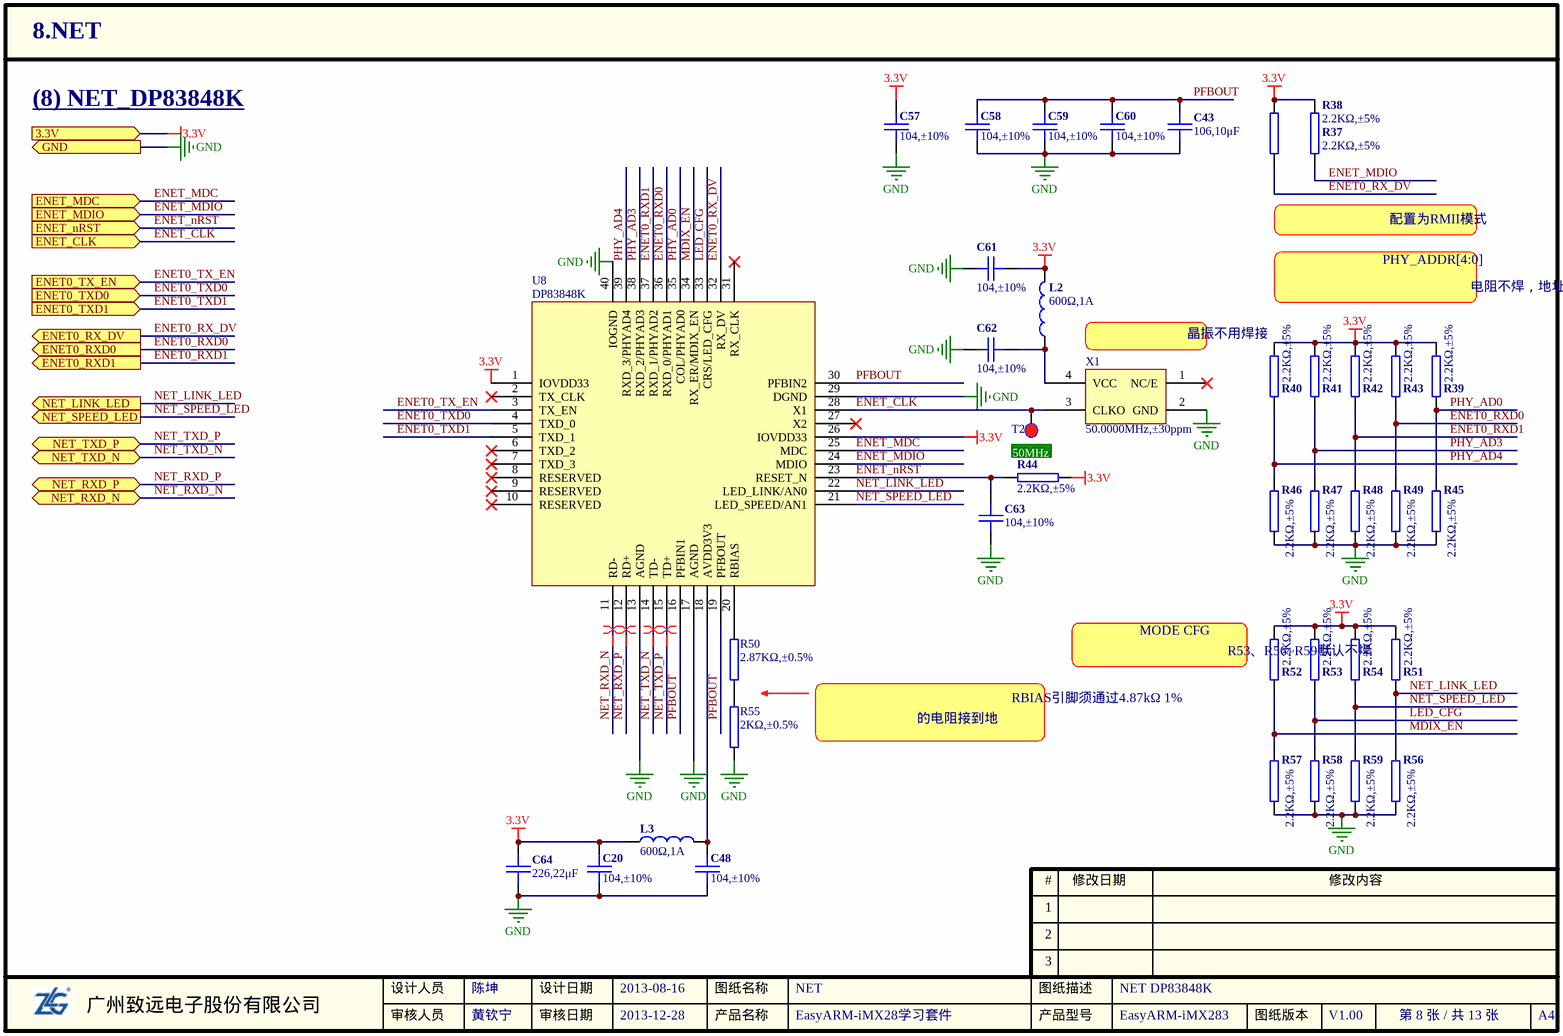
[diagram p6: 08. NET_DP83848K.SchDoc]

### Parts
C20  104,±10%  [0603C]
C43  106,10μF  [0805C]
C48  104,±10%  [0603C]
C57  104,±10%  [0603C]
C58  104,±10%  [0603C]
C59  104,±10%  [0603C]
C60  104,±10%  [0603C]
C61  104,±10%  [0603C]
C62  104,±10%  [0603C]
C63  104,±10%  [0603C]
C64  226,22μF  [0805C]
L2  value 600Ω,1A  [0603R]  (hidden comment: INDUCTOR1)
L3  value 600Ω,1A  [0603R]  (hidden comment: INDUCTOR1)
R37  2.2KΩ,±5%  [0603R]
R38  2.2KΩ,±5%  [0603R]
R39  2.2KΩ,±5%  [0603R]
R40  2.2KΩ,±5%  [0603R]
R41  2.2KΩ,±5%  [0603R]
R42  2.2KΩ,±5%  [0603R]
R43  2.2KΩ,±5%  [0603R]
R44  2.2KΩ,±5%  [0603R]
R45  2.2KΩ,±5%  [0603R]
R46  2.2KΩ,±5%  [0603R]
R47  2.2KΩ,±5%  [0603R]
R48  2.2KΩ,±5%  [0603R]
R49  2.2KΩ,±5%  [0603R]
R50  2.87KΩ,±0.5%  [0603R]
R51  2.2KΩ,±5%  [0603R]
R52  2.2KΩ,±5%  [0603R]
R53  2.2KΩ,±5%  [0603R]
R54  2.2KΩ,±5%  [0603R]
R55  2KΩ,±0.5%  [0603R]
R56  2.2KΩ,±5%  [0603R]
R57  2.2KΩ,±5%  [0603R]
R58  2.2KΩ,±5%  [0603R]
R59  2.2KΩ,±5%  [0603R]
T2  50MHz  [PAD-40]  (value not drawn)  (no BOM)
U8  DP83848K  [QFN50P600X600X100-41N]
X1  value 50.0000MHz,±30ppm  [XTAL4-5X3A]  (hidden comment: XTAL4-B)

### Ports
3.3V (in), ENET0_RX_DV (out), ENET0_RXD0 (out), ENET0_RXD1 (out), ENET0_TX_EN (in), ENET0_TXD0 (in), ENET0_TXD1 (in), ENET_CLK (in), ENET_MDC (in), ENET_MDIO (in), ENET_nRST (in), GND (out), NET_LINK_LED (out), NET_RXD_N (bidir), NET_RXD_P (bidir), NET_SPEED_LED (out), NET_TXD_N (bidir), NET_TXD_P (bidir)

### Nets
3.3V: C20.1 C57.1 C61.2 C64.1 L2.1 L3.2 R37.2 R38.2 R39.1 R40.1 R41.1 R42.1 R43.1 R44.1 R51.1 R52.1 R53.1 R54.1 U8.1(IOVDD33) U8.26(IOVDD33) ; port 3.3V
GND: C20.2 C43.2 C48.2 C57.2 C58.2 C59.2 C60.2 C61.1 C62.1 C63.1 C64.2 R45.2 R46.2 R47.2 R48.2 R49.2 R55.1 R56.2 R57.2 R58.2 R59.2 U8.13(AGND) U8.17(AGND) U8.29(DGND) U8.40(IOGND) U8.41(DAP) X1.2(GND) ; port GND
ENET0_RX_DV: R37.1 U8.32(RX_DV) ; port ENET0_RX_DV
ENET0_RXD0: R43.2 R49.1 U8.36(RXD_0/PHYAD1) ; port ENET0_RXD0
ENET0_RXD1: R42.2 R48.1 U8.37(RXD_1/PHYAD2) ; port ENET0_RXD1
ENET0_TX_EN: U8.3(TX_EN) ; port ENET0_TX_EN
ENET0_TXD0: U8.4(TXD_0) ; port ENET0_TXD0
ENET0_TXD1: U8.5(TXD_1) ; port ENET0_TXD1
ENET_CLK: T2.1 U8.28(X1) X1.3(CLKO) ; port ENET_CLK
ENET_MDC: U8.25(MDC) ; port ENET_MDC
ENET_MDIO: R38.1 U8.24(MDIO) ; port ENET_MDIO
ENET_nRST: C63.2 R44.2 U8.23(RESET_N) ; port ENET_nRST
LED_CFG: R53.2 R58.1 U8.33(CRS/LED_CFG)
MDIX_EN: R52.2 R57.1 U8.34(RX_ER/MDIX_EN)
NET_LINK_LED: R51.2 R56.1 U8.22(LED_LINK/AN0) ; port NET_LINK_LED
NET_RXD_N: U8.11(RD-) ; port NET_RXD_N
NET_RXD_P: U8.12(RD+) ; port NET_RXD_P
NET_SPEED_LED: R54.2 R59.1 U8.21(LED_SPEED/AN1) ; port NET_SPEED_LED
NET_TXD_N: U8.14(TD-) ; port NET_TXD_N
NET_TXD_P: U8.15(TD+) ; port NET_TXD_P
PFBOUT: C43.1 C58.1 C59.1 C60.1 U8.16(PFBIN1) U8.19(PFBOUT) U8.30(PFBIN2)
PHY_AD0: R39.2 R45.1 U8.35(COL/PHYAD0)
PHY_AD3: R41.2 R47.1 U8.38(RXD_2/PHYAD3)
PHY_AD4: R40.2 R46.1 U8.39(RXD_3/PHYAD4)
NetC48_1: C48.1 L3.1 U8.18(AVDD3V3)
NetC62_2: C62.2 L2.2 X1.4(VCC)
NetR50_1: R50.1 R55.2
NetR50_2: R50.2 U8.20(RBIAS)

Not connected (* = marked no-connect by the designer): U8 2(TX_CLK)* 6(TXD_2)* 7(TXD_3)* 8(RESERVED)* 9(RESERVED)* 10(RESERVED)* 27(X2)* 31(RX_CLK)*; X1 1(NC/E)*

### Layout directives
differential pair: NET_RXD_N, NET_RXD_P, NET_TXD_N, NET_TXD_P

### Notes on the sheet
- (8) NET_DP83848K
- 配置为RMII模式
- PHY_ADDR[4:0]
- 电阻不焊，地址默认为00001
- (near X1) 晶振不用焊接
- 50MHz
- MODE CFG
- (near R52) R53、R56~R59默认不焊
- RBIAS引脚须通过4.87kΩ 1%
- 的电阻接到地
- 1
- #
- 修改日期
- 修改内容
- 2
- 3
- 广州致远电子股份有限公司
- 设计人员
- 审核人员
- 设计日期
- 审核日期
- 产品名称
- 图纸名称
- 产品型号
- 图纸描述
- 图纸版本
- A4

### Library data of the parts
C20 C48 C57-C62 = 1.02.01.0032: 104,±10%,50V,X7R,0603,*,RoHS; 名称: 电容; 封装: 0603; 设备封装名称: C0603_104_X7R_50V_10%; 贴片和直插: SMT; 器件优选方案: 优先选用; 物料代码: 1.02.01.0032; Value: 104,±10%; RoHS: RoHS; 型号: 104,±10%,50V,X7R; ComponentLink1Description: ErpDataInfo; ComponentLink1URL: http://erp.zlgmcu.com/ErpExt/ErpData/ListMateriel.aspx?pkey=1.02.01.0032
C43 = 1.02.02.0055: 106,10μF,±10%,10V,X5R,0805,RoHS; 名称: 电容; 封装: 0805; 设备封装名称: C0805_106_X5R_10V_10%; 贴片和直插: SMT; 物料代码: 1.02.02.0055; Value: 106,10μF; RoHS: RoHS; 型号: 106,10μF,±10%,10V,X5R; ComponentLink1Description: ErpDataInfo; ComponentLink1URL: http://erp.zlgmcu.com/ErpExt/ErpData/ListMateriel.aspx?pkey=1.02.02.0055
C63 = 1.02.01.0032: as C12 on sheet 05. UART; 物料代码: 1.02.01.0032; Value: 104,±10%; RoHS: RoHS; 型号: 104,±10%,50V,X7R; ComponentLink1Description: ErpDataInfo; ComponentLink1URL: http://erp.zlgmcu.com/ErpExt/ErpData/ListMateriel.aspx?pkey=1.02.01.0032
C64 = 1.02.02.0059: 226,22μF,±20%,6.3V,X5R,0805,RoHS; 名称: 电容; 封装: 0805; 设备封装名称: C0805_226_X5R_6.3V_20%; 贴片和直插: SMT; 物料代码: 1.02.02.0059; Value: 226,22μF; RoHS: RoHS; 型号: 226,22μF,±20%,6.3V,X5R; ComponentLink1Description: ErpDataInfo; ComponentLink1URL: http://erp.zlgmcu.com/ErpExt/ErpData/ListMateriel.aspx?pkey=1.02.02.0059
L2 L3 = 1.03.03.0012: 600Ω,1A,DCR200mΩ,BH03Y314S-600R,SMD,0603,丰晶,RoHS; 名称: 磁珠; 封装: 0603; 贴片和直插: SMT; 物料代码: 1.03.03.0012; 厂商: 丰晶; RoHS: RoHS; 型号: 600Ω,1A,DCR200mΩ,BH03Y314S-600R,SMD; ComponentLink1Description: ErpDataInfo; ComponentLink1URL: http://erp.zlgmcu.com/ErpExt/ErpData/ListMateriel.aspx?pkey=1.03.03.0012
R37-R49 R51-R54 R56-R59 = 1.01.01.0039: 2.2KΩ,±5%,0603,RoHS; 名称: 电阻; 封装: 0603; 设备封装名称: R0603_2.2K; 贴片和直插: SMT; 物料代码: 1.01.01.0039; Value: 2.2KΩ,±5%; RoHS: RoHS; 型号: 2.2KΩ,±5%; ComponentLink1Description: ErpDataInfo; ComponentLink1URL: http://erp.zlgmcu.com/ErpExt/ErpData/ListMateriel.aspx?pkey=1.01.01.0039
R50 = 1.01.01.0109: 2.87KΩ,±0.5%,0603,*,RoHS; 名称: 电阻; 封装: 0603; 设备封装名称: R0603_2.87K_0.5%; 贴片和直插: SMT; 物料代码: 1.01.01.0109; Value: 2.87KΩ,±0.5%; RoHS: RoHS; 型号: 2.87KΩ,±0.5%; ComponentLink1Description: ErpDataInfo; ComponentLink1URL: http://erp.zlgmcu.com/ErpExt/ErpData/ListMateriel.aspx?pkey=1.01.01.0109
R55 = 1.01.01.0084: 2KΩ,±0.5%,0603,*,RoHS; 名称: 电阻; 封装: 0603; 设备封装名称: R0603_2K_0.5%; 贴片和直插: SMT; 物料代码: 1.01.01.0084; Value: 2KΩ,±0.5%; RoHS: RoHS; 型号: 2KΩ,±0.5%; ComponentLink1Description: ErpDataInfo; ComponentLink1URL: http://erp.zlgmcu.com/ErpExt/ErpData/ListMateriel.aspx?pkey=1.01.01.0084
T2 = TEST-DOT
U8 = DP83848K: Industrial Temperature Single Port 10/100 Ethernet Transceiver
X1 = 1.07.03.0037: 50.0000MHz,±30ppm,3.3V,OE,-40~85℃,SMD5032,,RoHS; 名称: 晶体振荡器; 贴片和直插: SMT; 物料代码: 1.07.03.0037; 封装: SMD5032; RoHS: RoHS; 型号: 50.0000MHz,±30ppm,3.3V,OE,-40~85℃; ComponentLink1Description: ErpDataInfo; ComponentLink1URL: http://erp.zlgmcu.com/ErpExt/ErpData/ListMateriel.aspx?pkey=1.07.03.0037